# EAGLE design pokeymax4 (EAGLE 6.6.0)

## Sheet 1 of 7: IO
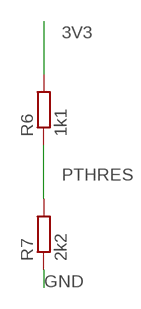
[diagram p0: schematic, sheet 1]

### Parts
R6  1k1  R-EU_R0402  [R0402]
R7  2k2  R-EU_R0402  [R0402]

### Nets
3V3: R6.2 ; also sheet 2,3,4,6
GND: R7.1 ; also sheet 2,3,4,5,6,7
PTHRES: R6.1 R7.2 ; also sheet 2

## Sheet 2 of 7: FPGA
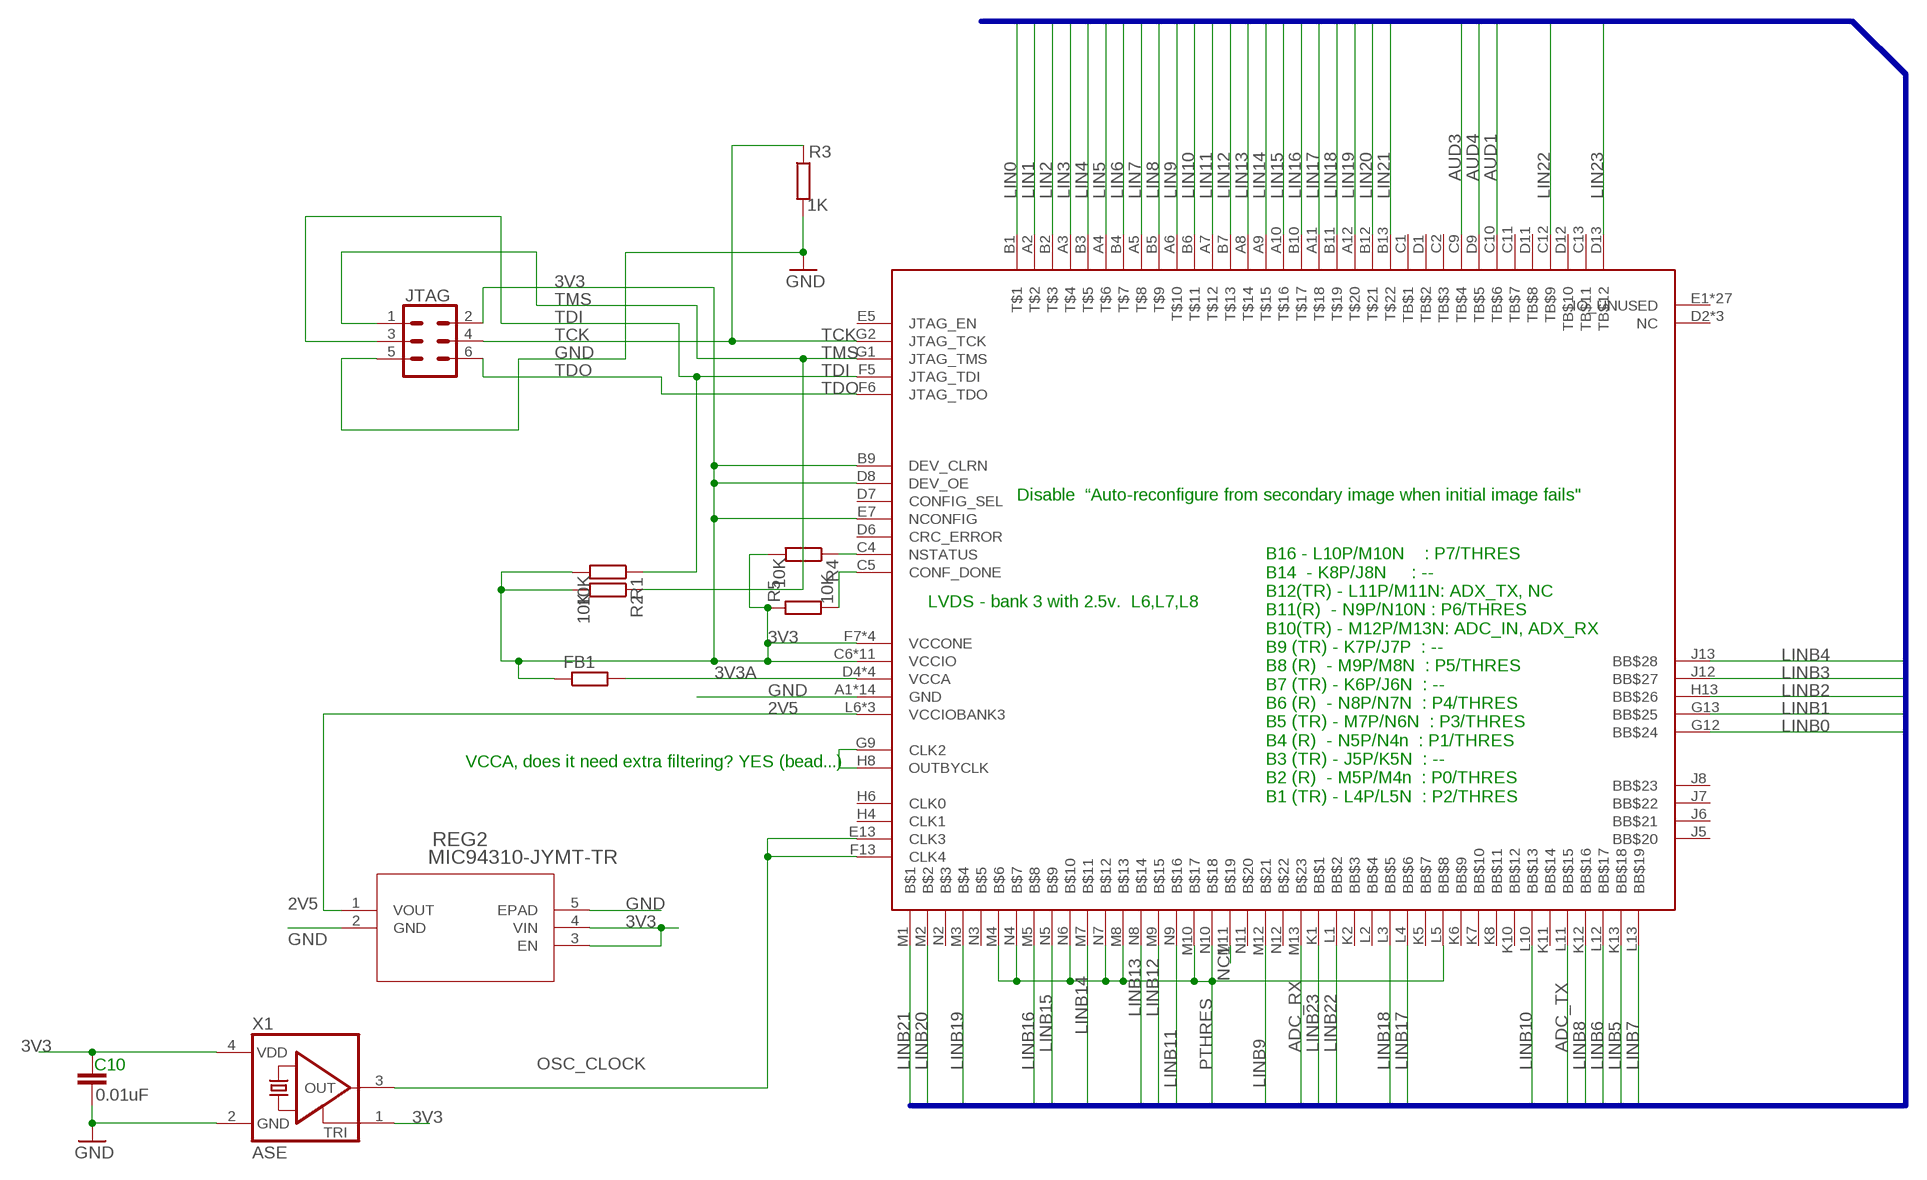
[diagram p1: schematic, sheet 2]

### Parts
C10  0.01uF  C-EUC0402  [C0402]
FB1  R-EU_R0402  [R0402]
JTAG  CONN_03X2LOCK  [2X3_LOCK]
R1  10K  R-EU_R0402  [R0402]
R2  10K  R-EU_R0402  [R0402]
R3  1K  R-EU_R0402  [R0402]
R4  10K  R-EU_R0402  [R0402]
R5  10K  R-EU_R0402  [R0402]
REG2  MIC94310-JYMT-TR  [TDFN4_1P2X1P6_MCH]
U3  MAX10  [U169SMALL]
X1  ASE  [ASE]

### Nets
2V5: REG2.1(VOUT) U3.L6(VCCIOBANK3) U3.L7(VCCIOBANK3) U3.L8(VCCIOBANK3) ; also sheet 6,7
3V3: C10.1 FB1.1 JTAG.2 R1.2 R2.2 R4.2 R5.1 REG2.3(EN) REG2.4(VIN) U3.B9(DEV_CLRN) U3.C6(VCCIO) U3.C7(VCCIO) U3.C8(VCCIO) U3.D8(DEV_OE) U3.E7(NCONFIG) U3.F2(VCCIO) U3.F7(VCCONE) U3.F11(VCCIO) U3.G3(VCCIO) U3.G6(VCCONE) U3.G8(VCCONE) U3.G11(VCCIO) U3.H7(VCCONE) U3.H11(VCCIO) U3.J3(VCCIO) U3.J11(VCCIO) U3.K3(VCCIO) X1.1(TRI) X1.4(VDD) ; also sheet 1,3,4,6
3V3A: FB1.2 U3.D4(VCCA) U3.D10(VCCA) U3.K4(VCCA) U3.K9(VCCA) ; also sheet 6
ADC_RX: U3.M13(B$23) ; also sheet 7
ADC_TX: U3.L11(BB$15) ; also sheet 7
AUD1: U3.C10(TB$6) ; also sheet 5
AUD3: U3.C9(TB$4) ; also sheet 5
AUD4: U3.D9(TB$5) ; also sheet 5
CONF_DONE: R5.2 U3.C5(CONF_DONE)
FAKE_CLK: U3.G9(CLK2) U3.H8(OUTBYCLK)
GND: C10.2 JTAG.5 R3.2 REG2.2(GND) REG2.5(EPAD) U3.A1(GND) U3.A13(GND) U3.B8(GND) U3.C3(GND) U3.D5(GND) U3.E11(GND) U3.F3(GND) U3.G7(GND) U3.H12(GND) U3.J4(GND) U3.L9(GND) U3.M6(GND) U3.N1(GND) U3.N13(GND) X1.2(GND) ; also sheet 1,3,4,5,6,7
LIN0: U3.B1(T$1) ; also sheet 3
LIN1: U3.A2(T$2) ; also sheet 3
LIN2: U3.B2(T$3) ; also sheet 3
LIN3: U3.A3(T$4) ; also sheet 3
LIN4: U3.B3(T$5) ; also sheet 3
LIN5: U3.A4(T$6) ; also sheet 3
LIN6: U3.B4(T$7) ; also sheet 3
LIN7: U3.A5(T$8) ; also sheet 3
LIN8: U3.B5(T$9) ; also sheet 3
LIN9: U3.A6(T$10) ; also sheet 3
LIN10: U3.B6(T$11) ; also sheet 3
LIN11: U3.A7(T$12) ; also sheet 3
LIN12: U3.B7(T$13) ; also sheet 3
LIN13: U3.A8(T$14) ; also sheet 3
LIN14: U3.A9(T$15) ; also sheet 3
LIN15: U3.A10(T$16) ; also sheet 3
LIN16: U3.B10(T$17) ; also sheet 3
LIN17: U3.A11(T$18) ; also sheet 3
LIN18: U3.B11(T$19) ; also sheet 3
LIN19: U3.A12(T$20) ; also sheet 3
LIN20: U3.B12(T$21) ; also sheet 3
LIN21: U3.B13(T$22) ; also sheet 3
LIN22: U3.C12(TB$9) ; also sheet 3
LIN23: U3.D13(TB$12) ; also sheet 3
LINB0: U3.G12(BB$24) ; also sheet 3
LINB1: U3.G13(BB$25) ; also sheet 3
LINB2: U3.H13(BB$26) ; also sheet 3
LINB3: U3.J12(BB$27) ; also sheet 3
LINB4: U3.J13(BB$28) ; also sheet 3
LINB5: U3.K13(BB$18) ; also sheet 3
LINB6: U3.L12(BB$17) ; also sheet 3
LINB7: U3.L13(BB$19) ; also sheet 3
LINB8: U3.K12(BB$16) ; also sheet 3
LINB9: U3.M12(B$21) ; also sheet 3,7
LINB10: U3.L10(BB$13) ; also sheet 3
LINB11: U3.N9(B$16) ; also sheet 3
LINB12: U3.M9(B$15) ; also sheet 3
LINB13: U3.N8(B$14) ; also sheet 3
LINB14: U3.M7(B$11) ; also sheet 3
LINB15: U3.N5(B$9) ; also sheet 3
LINB16: U3.M5(B$8) ; also sheet 3
LINB17: U3.L4(BB$6) ; also sheet 3
LINB18: U3.L3(BB$5) ; also sheet 3
LINB19: U3.M3(B$4) ; also sheet 3
LINB20: U3.M2(B$2) ; also sheet 3
LINB21: U3.M1(B$1) ; also sheet 3
LINB22: U3.L1(BB$2) ; also sheet 3
LINB23: U3.K1(BB$1) ; also sheet 3
NC1: U3.M11(B$19)
NSTATUS: R4.1 U3.C4(NSTATUS)
OSC_CLOCK: U3.E13(CLK3) U3.F13(CLK4) X1.3(OUT)
PTHRES: U3.L5(BB$8) U3.M4(B$6) U3.M8(B$13) U3.M10(B$17) U3.N4(B$7) U3.N6(B$10) U3.N7(B$12) U3.N10(B$18) ; also sheet 1
TCK: JTAG.4 R3.1 U3.G2(JTAG_TCK)
TDI: JTAG.3 R1.1 U3.F5(JTAG_TDI)
TDO: JTAG.6 U3.F6(JTAG_TDO)
TMS: JTAG.1 R2.1 U3.G1(JTAG_TMS)
Unconnected: U3.C1(TB$1) U3.C2(TB$3) U3.C11(TB$7) U3.C13(TB$11) U3.D1(TB$2) U3.D2(NC) U3.D3(NC) U3.D6(CRC_ERROR) U3.D7(CONFIG_SEL) U3.D11(TB$8) U3.D12(TB$10) U3.E1(IO_UNUSED) U3.E2(NC) U3.E3(IO_UNUSED) U3.E4(IO_UNUSED) U3.E5(JTAG_EN) U3.E6(IO_UNUSED) U3.E8(IO_UNUSED) U3.E9(IO_UNUSED) U3.E10(IO_UNUSED) U3.E12(IO_UNUSED) U3.F1(IO_UNUSED) U3.F4(IO_UNUSED) U3.F8(IO_UNUSED) U3.F9(IO_UNUSED) U3.F10(IO_UNUSED) U3.F12(IO_UNUSED) U3.G4(IO_UNUSED) U3.G5(IO_UNUSED) U3.G10(IO_UNUSED) U3.H1(IO_UNUSED) U3.H2(IO_UNUSED) U3.H3(IO_UNUSED) U3.H4(CLK1) U3.H5(IO_UNUSED) U3.H6(CLK0) U3.H9(IO_UNUSED) U3.H10(IO_UNUSED) U3.J1(IO_UNUSED) U3.J2(IO_UNUSED) U3.J5(BB$20) U3.J6(BB$21) U3.J7(BB$22) U3.J8(BB$23) U3.J9(IO_UNUSED) U3.J10(IO_UNUSED) U3.K2(BB$3) U3.K5(BB$7) U3.K6(BB$9) U3.K7(BB$10) U3.K8(BB$11) U3.K10(BB$12) U3.K11(BB$14) U3.L2(BB$4) U3.N2(B$3) U3.N3(B$5) U3.N11(B$20) U3.N12(B$22)

### Buses
LINB[0..23],LIN[0..23],AUD[1..4],POTM[0..7],PTHRES,ADC_RX,ADC_TX

### Notes on the sheet
- Disable  “Auto-reconfigure from secondary image when initial image fails"
- LVDS - bank 3 with 2.5v.  L6,L7,L8
- VCCA, does it need extra filtering? YES (bead...)
- B16 - L10P/M10N    : P7/THRES
  B14  - K8P/J8N     : --
  B12(TR) - L11P/M11N: ADX_TX, NC
  B11(R)  - N9P/N10N : P6/THRES
  B10(TR) - M12P/M13N: ADC_IN, ADX_RX
  B9 (TR) - K7P/J7P  : --
  B8 (R)  - M9P/M8N  : P5/THRES
  B7 (TR) - K6P/J6N  : --
  B6 (R)  - N8P/N7N  : P4/THRES
  B5 (TR) - M7P/N6N  : P3/THRES
  B4 (R)  - N5P/N4n  : P1/THRES
  B3 (TR) - J5P/K5N  : --
  B2 (R)  - M5P/M4n  : P0/THRES
  B1 (TR) - L4P/L5N  : P2/THRES

## Sheet 3 of 7: Level conv
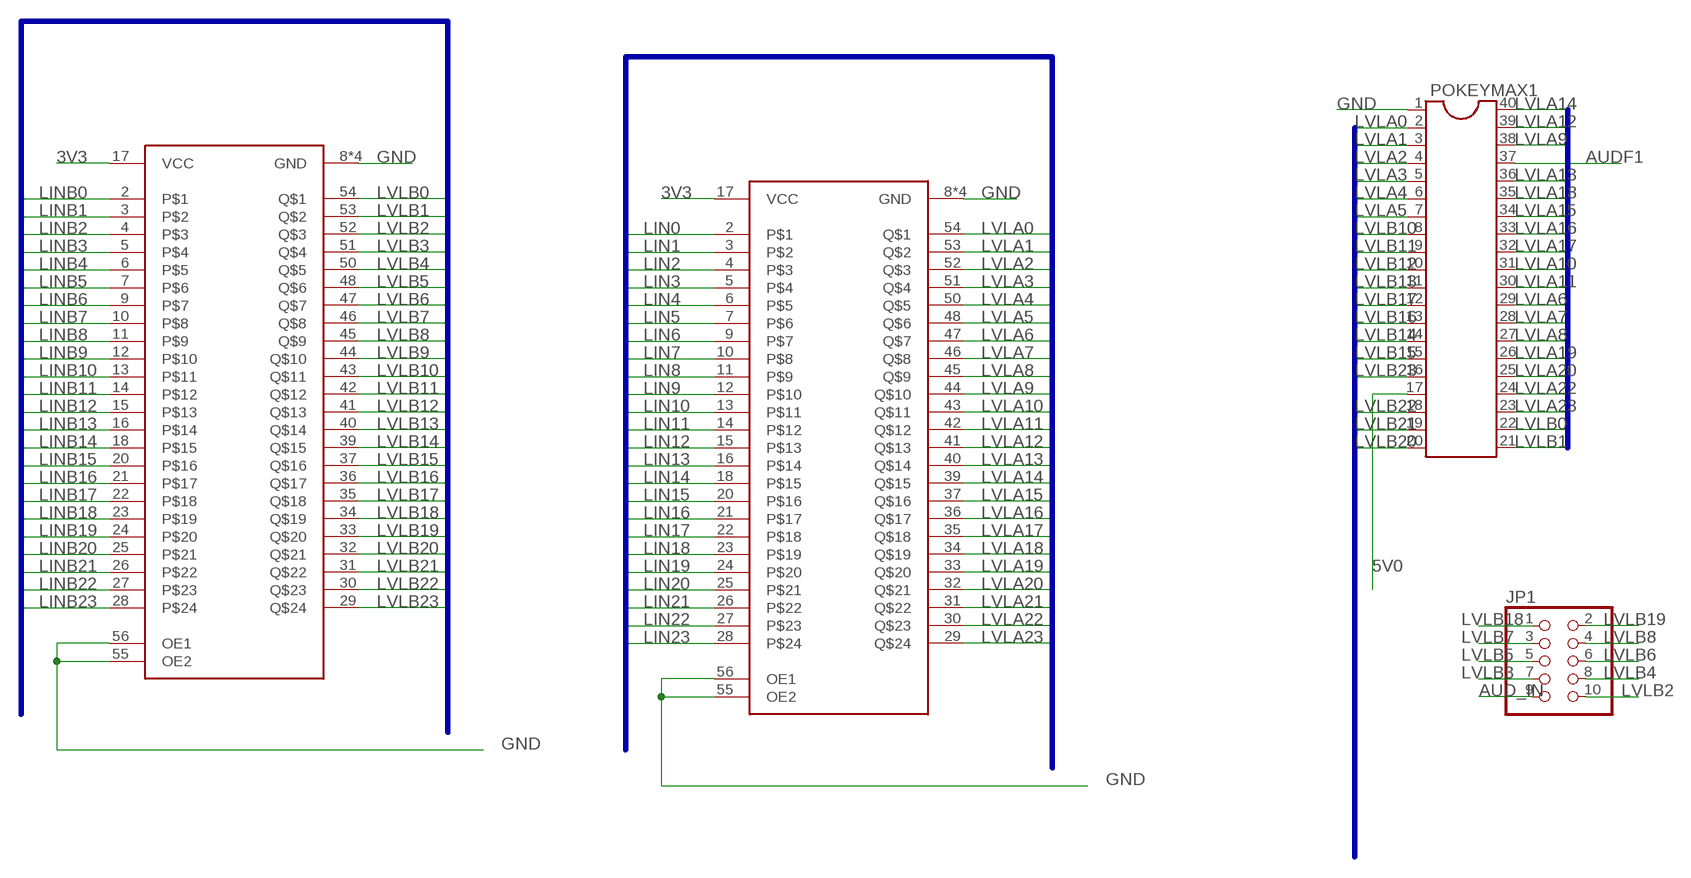
[diagram p2: schematic, sheet 3]

### Parts
JP1  PINHD-2X5  [2X05]
POKEYMAX1  DIL40  [DIL40]
U2  SN74CB3T16211SM  [56TVSOP_SMALL]
U4  SN74CB3T16211SM  [56TVSOP_SMALL]

### Nets
3V3: U2.17(VCC) U4.17(VCC) ; also sheet 1,2,4,6
5V0: POKEYMAX1.17 ; also sheet 4,5,6
AUD_IN: JP1.9 ; also sheet 7
AUDF1: POKEYMAX1.37 ; also sheet 5
GND: POKEYMAX1.1 U2.8(GND) U2.19(GND) U2.38(GND) U2.49(GND) U2.55(OE2) U2.56(OE1) U4.8(GND) U4.19(GND) U4.38(GND) U4.49(GND) U4.55(OE2) U4.56(OE1) ; also sheet 1,2,4,5,6,7
LIN0: U2.2 ; also sheet 2
LIN1: U2.3 ; also sheet 2
LIN2: U2.4 ; also sheet 2
LIN3: U2.5 ; also sheet 2
LIN4: U2.6 ; also sheet 2
LIN5: U2.7 ; also sheet 2
LIN6: U2.9 ; also sheet 2
LIN7: U2.10 ; also sheet 2
LIN8: U2.11 ; also sheet 2
LIN9: U2.12 ; also sheet 2
LIN10: U2.13 ; also sheet 2
LIN11: U2.14 ; also sheet 2
LIN12: U2.15 ; also sheet 2
LIN13: U2.16 ; also sheet 2
LIN14: U2.18 ; also sheet 2
LIN15: U2.20 ; also sheet 2
LIN16: U2.21 ; also sheet 2
LIN17: U2.22 ; also sheet 2
LIN18: U2.23 ; also sheet 2
LIN19: U2.24 ; also sheet 2
LIN20: U2.25 ; also sheet 2
LIN21: U2.26 ; also sheet 2
LIN22: U2.27 ; also sheet 2
LIN23: U2.28 ; also sheet 2
LINB0: U4.2 ; also sheet 2
LINB1: U4.3 ; also sheet 2
LINB2: U4.4 ; also sheet 2
LINB3: U4.5 ; also sheet 2
LINB4: U4.6 ; also sheet 2
LINB5: U4.7 ; also sheet 2
LINB6: U4.9 ; also sheet 2
LINB7: U4.10 ; also sheet 2
LINB8: U4.11 ; also sheet 2
LINB9: U4.12 ; also sheet 2,7
LINB10: U4.13 ; also sheet 2
LINB11: U4.14 ; also sheet 2
LINB12: U4.15 ; also sheet 2
LINB13: U4.16 ; also sheet 2
LINB14: U4.18 ; also sheet 2
LINB15: U4.20 ; also sheet 2
LINB16: U4.21 ; also sheet 2
LINB17: U4.22 ; also sheet 2
LINB18: U4.23 ; also sheet 2
LINB19: U4.24 ; also sheet 2
LINB20: U4.25 ; also sheet 2
LINB21: U4.26 ; also sheet 2
LINB22: U4.27 ; also sheet 2
LINB23: U4.28 ; also sheet 2
LVLA0: POKEYMAX1.2 U2.54(Q$1)
LVLA1: POKEYMAX1.3 U2.53(Q$2)
LVLA2: POKEYMAX1.4 U2.52(Q$3)
LVLA3: POKEYMAX1.5 U2.51(Q$4)
LVLA4: POKEYMAX1.6 U2.50(Q$5)
LVLA5: POKEYMAX1.7 U2.48(Q$6)
LVLA6: POKEYMAX1.29 U2.47(Q$7)
LVLA7: POKEYMAX1.28 U2.46(Q$8)
LVLA8: POKEYMAX1.27 U2.45(Q$9)
LVLA9: POKEYMAX1.38 U2.44(Q$10)
LVLA10: POKEYMAX1.31 U2.43(Q$11)
LVLA11: POKEYMAX1.30 U2.42(Q$12)
LVLA12: POKEYMAX1.39 U2.41(Q$13)
LVLA13: POKEYMAX1.36 U2.40(Q$14)
LVLA14: POKEYMAX1.40 U2.39(Q$15)
LVLA15: POKEYMAX1.34 U2.37(Q$16)
LVLA16: POKEYMAX1.33 U2.36(Q$17)
LVLA17: POKEYMAX1.32 U2.35(Q$18)
LVLA18: POKEYMAX1.35 U2.34(Q$19)
LVLA19: POKEYMAX1.26 U2.33(Q$20)
LVLA20: POKEYMAX1.25 U2.32(Q$21)
LVLA21: U2.31(Q$22) ; also sheet 5
LVLA22: POKEYMAX1.24 U2.30(Q$23)
LVLA23: POKEYMAX1.23 U2.29(Q$24)
LVLB0: POKEYMAX1.22 U4.54(Q$1)
LVLB1: POKEYMAX1.21 U4.53(Q$2)
LVLB2: JP1.10 U4.52(Q$3)
LVLB3: JP1.7 U4.51(Q$4)
LVLB4: JP1.8 U4.50(Q$5)
LVLB5: JP1.5 U4.48(Q$6)
LVLB6: JP1.6 U4.47(Q$7)
LVLB7: JP1.3 U4.46(Q$8)
LVLB8: JP1.4 U4.45(Q$9)
LVLB9: U4.44(Q$10) ; also sheet 7
LVLB10: POKEYMAX1.8 U4.43(Q$11)
LVLB11: POKEYMAX1.9 U4.42(Q$12)
LVLB12: POKEYMAX1.10 U4.41(Q$13)
LVLB13: POKEYMAX1.11 U4.40(Q$14)
LVLB14: POKEYMAX1.14 U4.39(Q$15)
LVLB15: POKEYMAX1.15 U4.37(Q$16)
LVLB16: POKEYMAX1.13 U4.36(Q$17)
LVLB17: POKEYMAX1.12 U4.35(Q$18)
LVLB18: JP1.1 U4.34(Q$19)
LVLB19: JP1.2 U4.33(Q$20)
LVLB20: POKEYMAX1.20 U4.32(Q$21)
LVLB21: POKEYMAX1.19 U4.31(Q$22)
LVLB22: POKEYMAX1.18 U4.30(Q$23)
LVLB23: POKEYMAX1.16 U4.29(Q$24)

### Buses
LINB[0..23],LVLB[0..23]
LVLA[0..23],LVLB[0..7],KR[1..2],K[0..5]
LVLA[0..23],LVLB[0..23],POT[0..7],POTCH[0..7],KR[1..2],K[0..5]
LIN[0..23],LVLA[0..23]

## Sheet 4 of 7: Power regs
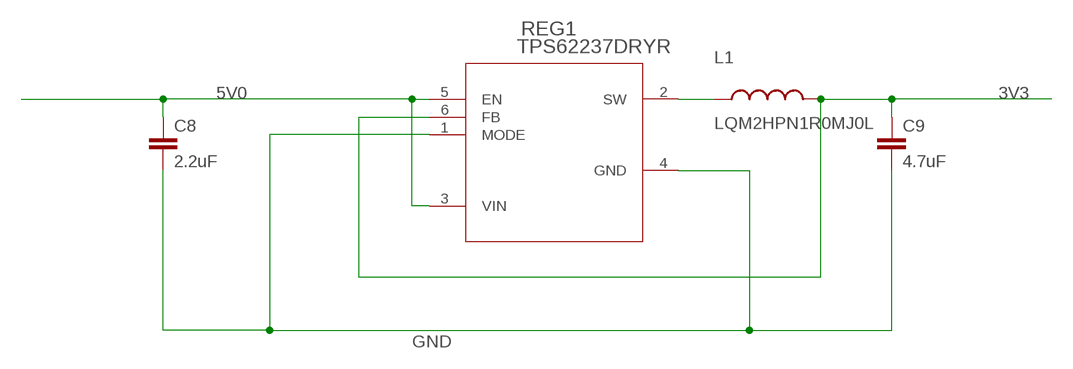
[diagram p3: schematic, sheet 4]

### Parts
C8  2.2uF  C-EUC0402  [C0402]
C9  4.7uF  C-EUC0402  [C0402]
L1  LQM2HPN1R0MJ0L  [INDC1008X04]
REG1  TPS62237DRYR  [DRY6]

### Nets
3V3: C9.1 L1.2 REG1.6(FB) ; also sheet 1,2,3,6
5V0: C8.1 REG1.3(VIN) REG1.5(EN) ; also sheet 3,5,6
GND: C8.2 C9.2 REG1.1(MODE) REG1.4(GND) ; also sheet 1,2,3,5,6,7
N$137: L1.1 REG1.2(SW)

## Sheet 5 of 7: Audio filter
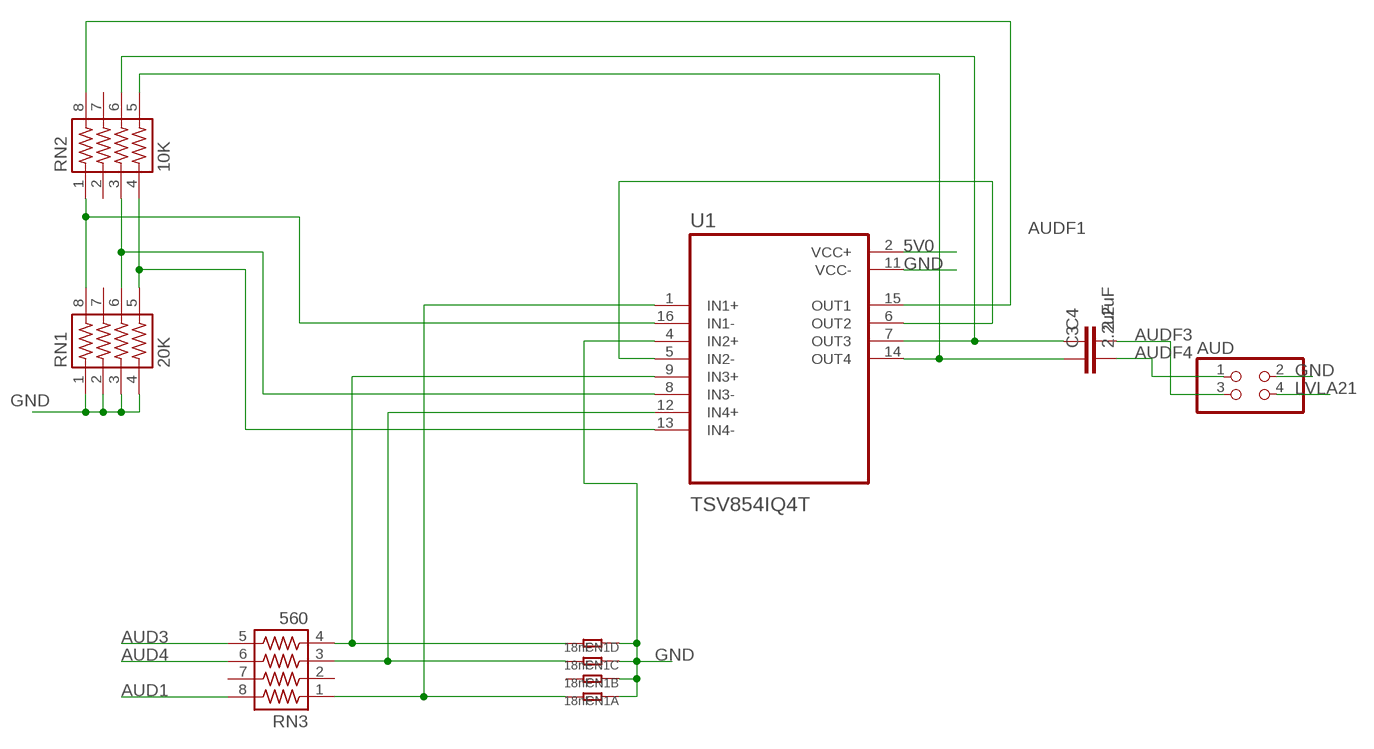
[diagram p4: schematic, sheet 5]

### Parts
AUD  PINHD-2X2  [2X02]
C3  2.2uF  C-EUC0402  [C0402]
C4  2.2uF  C-EUC0402  [C0402]
CN1  18nF  R-4R  [R1206-8]
RN1  20K  741-8  [741-8]
RN2  10K  741-8  [741-8]
RN3  560  741-8  [741-8]
U1  TSV854IQ4T  [QFN50P300X300X100-16N]

### Nets
5V0: U1.2(VCC+) ; also sheet 3,4,6
AMPIN1M: RN1.8 RN2.1 U1.16(IN1-)
AMPIN1P: CN1.8 RN3.1 U1.1(IN1+)
AMPIN3M: RN1.6 RN2.3 U1.8(IN3-)
AMPIN3P: CN1.5 RN3.4 U1.9(IN3+)
AMPIN4P: CN1.6 RN3.3 U1.12(IN4+)
AUD1: RN3.8 ; also sheet 2
AUD3: RN3.5 ; also sheet 2
AUD4: RN3.6 ; also sheet 2
AUDF1: RN2.8 U1.15(OUT1) ; also sheet 3
AUDF2: U1.5(IN2-) U1.6(OUT2)
AUDF3: AUD.3 C4.2
AUDF4: AUD.1 C3.2
GND: AUD.2 CN1.1 CN1.2 CN1.3 CN1.4 RN1.1 RN1.2 RN1.3 RN1.4 U1.4(IN2+) U1.11(VCC-) ; also sheet 1,2,3,4,6,7
LVLA21: AUD.4 ; also sheet 3
N$5: C3.1 RN2.5 U1.14(OUT4)
N$7: C4.1 RN2.6 U1.7(OUT3)
N$22: RN1.5 RN2.4 U1.13(IN4-)
Unconnected: CN1.7 RN1.7 RN2.2 RN2.7 RN3.2 RN3.7

## Sheet 6 of 7: Decoupling
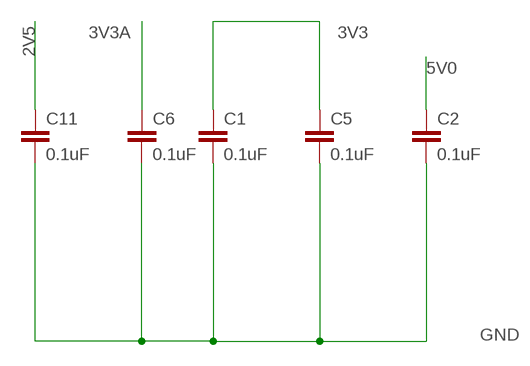
[diagram p5: schematic, sheet 6]

### Parts
C1  0.1uF  C-EUC0402  [C0402]
C2  0.1uF  C-EUC0402  [C0402]
C5  0.1uF  C-EUC0402  [C0402]
C6  0.1uF  C-EUC0402  [C0402]
C11  0.1uF  C-EUC0402  [C0402]

### Nets
2V5: C11.1 ; also sheet 2,7
3V3: C1.1 C5.1 ; also sheet 1,2,3,4
3V3A: C6.1 ; also sheet 2
5V0: C2.1 ; also sheet 3,4,5
GND: C1.2 C2.2 C5.2 C6.2 C11.2 ; also sheet 1,2,3,4,5,7

## Sheet 7 of 7: ADC
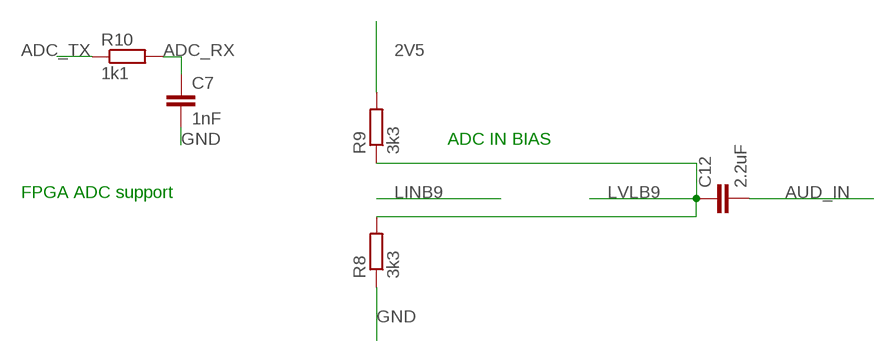
[diagram p6: schematic, sheet 7]

### Parts
C7  1nF  C-EUC0402  [C0402]
C12  2.2uF  C-EUC0402  [C0402]
R8  3k3  R-EU_R0402  [R0402]
R9  3k3  R-EU_R0402  [R0402]
R10  1k1  R-EU_R0402  [R0402]

### Nets
2V5: R9.2 ; also sheet 2,6
ADC_RX: C7.1 R10.2 ; also sheet 2
ADC_TX: R10.1 ; also sheet 2
AUD_IN: C12.2 ; also sheet 3
GND: C7.2 R8.1 ; also sheet 1,2,3,4,5,6
LVLB9: C12.1 R8.2 R9.1 ; also sheet 3

### Notes on the sheet
- ADC IN BIAS
- FPGA ADC support

## Library data of the parts
AUD = pinhead:PINHD-2X2: PIN HEADER
C1-C12 = rcl:C-EU: CAPACITOR, European symbol
CN1 = Discrete:R-4R*: Resistor Array
FB1 R1-R10 = rcl:R-EU_: RESISTOR, European symbol
JP1 = pinhead:PINHD-2X5: PIN HEADER
JTAG = SparkFun-Connectors:CONN_03X2: Multi connection point. Often used as Generic Header-pin footprint for 0.1 inch spaced/style header connections You can populate with any combo of single row headers, but if you'd like an exact match, check these: Header - 2x3 (Male, 0.1") <https://www.sparkfun.com/products/12807> (PRT-12807) Header - 2x3 (Female, 0.1") <https://www.sparkfun.com/products/13010> (PRT-13010) 2x3 Pin Shrouded Header <https://www.sparkfun.com/products/10877> (PRT-10877) On any of the 0.1 inch spaced packages, you can populate with these: Break Away Headers - Straight <https://www.sparkfun.com/products/116> (PRT-00116) Break Away Male Headers - Right Angle <https://www.sparkfun.com/products/553> (PRT-00553) Female Headers <https://www.sparkfun.com/products/115> (PRT-00115) Break Away Headers - Machine Pin <https://www.sparkfun.com/products/117> (PRT-00117) Break Away Female Headers - Swiss Machine Pin <https://www.sparkfun.com/products/743> (PRT-00743) Special note: the shrouded connector mates well with our 3x2 ribbon cables: Ribbon Crimp Connector - 6-pin (2x3, Female) <https://www.sparkfun.com/products/10651> (PRT-10651) Ribbon Cable - 6 wire (15ft) <https://www.sparkfun.com/products/10646> (PRT-10646)
L1 = LQM2HPN1R0MJ0L:LQM2HPN1R0MJ0L: Inductor Power Chip Shielded Multi-Layer 1uH 20% 1MHz Ferrite 1.5A 113mOhm DCR 1008 Embossed T/R; DESCRIPTION: Inductor Power Chip Shielded Multi-Layer 1uH 20% 1MHz Ferrite 1.5A 113mOhm DCR 1008 Embossed T/R; DIGI-KEY_PART_NUMBER: 490-6699-1-ND; DIGI-KEY_PURCHASE_URL: https://www.digikey.com/product-detail/en/murata-electronics-north-america/LQM2HPN1R0MJ0L/490-6699-1-ND/3845896?utm_source=snapeda&utm_medium=aggregator&utm_campaign=symbol; MF: Murata Electronics; MP: LQM2HPN1R0MJ0L; PACKAGE: 1008 Murata
POKEYMAX1 = ic-package:DIL40: Dual In Line
REG1 = max10:TPS62237DRYR; MANUFACTURER_PART_NUMBER: TPS62237DRYR; VENDOR: Texas Instruments
REG2 = max10:MIC94310-JYMT-TR; BUILT_BY: EMA_Jessica; COPYRIGHT: Copyright (C) 2018 Accelerated Designs. All rights reserved; MANUFACTURER_PART_NUMBER: MIC94310-JYMT-TR; SOURCELIBRARY: Microchip_2019-08-23_18; VENDOR: Microchip
RN1-RN3 = resistor-array:741-8: CTS 741 Series 8 Terminations, 4 Resistors
U1 = TSV854IQ4T:TSV854IQ4T: None; AVAILABILITY: Unavailable; DESCRIPTION: General Purpose Amplifier 4 Circuit Rail-to-Rail 16-QFN _3x3_; MF: STMicroelectronics; MP: TSV854IQ4T; PACKAGE: QFN-16 STMicroelectronics; PRICE: None
U2 U4 = max10:SN74CB3T16211
U3 = max10:MAX10
X1 = crystal:ASE: 3.3Vdc CMOS SMD CRYSTAL CLOCK OSCILLATOR SOurce: www.abracon.com; OC_FARNELL: unknown; OC_NEWARK: unknown

## Board
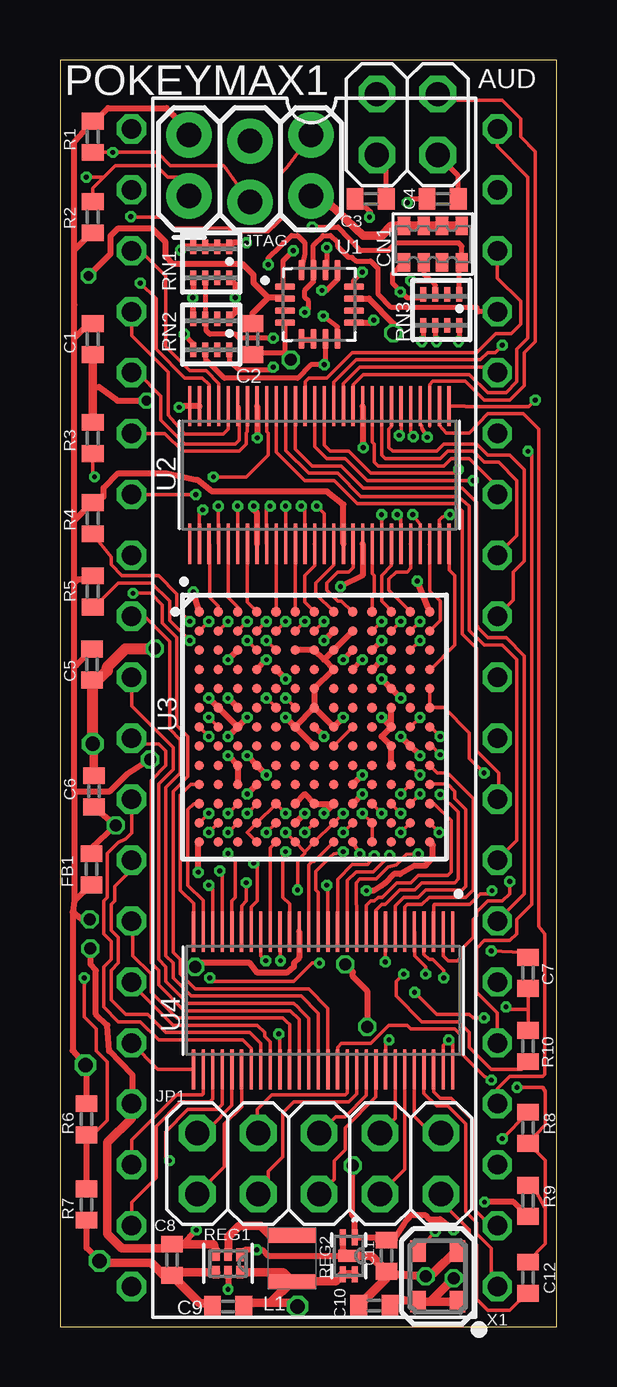
[diagram p7: board, top side]
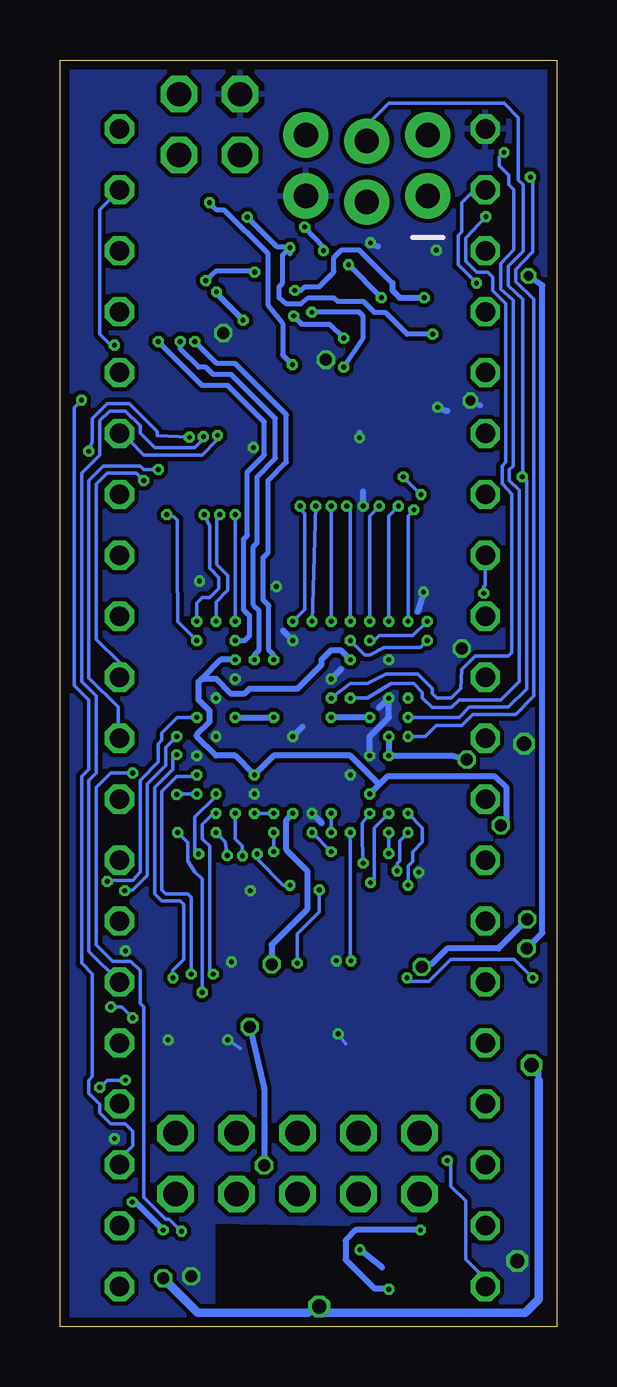
[diagram p8: board, bottom side, seen from below]

Size 20.7 x 52.8 mm. Coordinates in mm from the lower left corner, seen from the top.
Outline: 20.7,52.8 0,52.8 0,0 20.7,0 20.7,52.8
Copper layers (1*2*15*16): Top 0.035559375mm / dielectric 1.6mm / Route2 0.0356mm / dielectric 0.1499mm / Route15 0.0356mm / dielectric 0.2007mm / Bottom 0.035559375mm
Design rules "oshpark-2layer_5mil *": minimum track width 6mil, minimum drill 0.2mm, track to track 5mil, track to pad 5mil, pad to pad 5mil, via to via 5mil, smd to smd 5mil, copper to edge 15mil, drill to drill 6mil, minimum pad ring 5mil, minimum via ring 5mil, stop-mask expansion 2.5mil, vias tented up to drill 20mil, thermal gap 10mil

### Footprints (pad centres in the part's own frame; a part is rotated, then mirrored left to right if it is on the bottom)
2X02 = drill 1.016 octagon: 1 -1.27,-1.27; 2 -1.27,1.27; 3 1.27,-1.27; 4 1.27,1.27
C0402 = smd 0.7 x 0.9: 1 -0.65,0; 2 0.65,0
R1206-8 = smd 0.508 x 0.762: 1 -1.206,-0.762; 2 -0.381,-0.762; 3 0.381,-0.762; 4 1.206,-0.762; 5 1.206,0.762; 6 0.381,0.762; 7 -0.381,0.762; 8 -1.206,0.762
R0402 = smd 0.7 x 0.9: 1 -0.65,0; 2 0.65,0
2X05 = drill 1.016 octagon: 1 -5.08,-1.27; 2 -5.08,1.27; 3 -2.54,-1.27; 4 -2.54,1.27; 5 0,-1.27; 6 0,1.27; 7 2.54,-1.27; 8 2.54,1.27; 9 5.08,-1.27; 10 5.08,1.27
2X3_LOCK = drill 1.016 pad 1.88: 1 0,0.127; 2 0,2.667; 3 2.54,-0.127; 4 2.54,2.413; 5 5.08,0.127; 6 5.08,2.667
INDC1008X04 = smd 0.6 x 2: 1 -0.95,0; 2 0.95,0
DIL40 = drill 0.813 octagon: 1 -24.13,-7.62; 2 -21.59,-7.62; 3 -19.05,-7.62; 4 -16.51,-7.62; 5 -13.97,-7.62; 6 -11.43,-7.62; 7 -8.89,-7.62; 8 -6.35,-7.62; 9 -3.81,-7.62; 10 -1.27,-7.62; 11 1.27,-7.62; 12 3.81,-7.62; 13 6.35,-7.62; 14 8.89,-7.62; 15 11.43,-7.62; 16 13.97,-7.62; 17 16.51,-7.62; 18 19.05,-7.62; 19 21.59,-7.62; 20 24.13,-7.62; 21 24.13,7.62; 22 21.59,7.62; 23 19.05,7.62; 24 16.51,7.62; 25 13.97,7.62; 26 11.43,7.62; 27 8.89,7.62; 28 6.35,7.62; 29 3.81,7.62; 30 1.27,7.62; 31 -1.27,7.62; 32 -3.81,7.62; 33 -6.35,7.62; 34 -8.89,7.62; 35 -11.43,7.62; 36 -13.97,7.62; 37 -16.51,7.62; 38 -19.05,7.62; 39 -21.59,7.62; 40 -24.13,7.62
DRY6 = smd 0.55 x 0.3: 1 -0.355,0.5 | smd 0.52 x 0.3: 2 -0.37,0; 3 -0.37,-0.5; 4 0.37,-0.5; 5 0.37,0; 6 0.37,0.5
TDFN4_1P2X1P6_MCH = smd 0.66 x 0.254: 1 -0.775,0.254; 2 -0.775,-0.254; 3 0.775,-0.254; 4 0.775,0.254 | smd 0.508 x 0.864: 5 0,0
741-8 = smd 0.25 x 0.61: 1 -0.75,-0.65; 2 -0.25,-0.65; 3 0.25,-0.65; 4 0.75,-0.65; 5 0.75,0.65; 6 0.25,0.65; 7 -0.25,0.65; 8 -0.75,0.65
QFN50P300X300X100-16N = smd 0.84 x 0.26: 1 -1.435,0.75; 2 -1.435,0.25; 3 -1.435,-0.25; 4 -1.435,-0.75; 9 1.435,-0.75; 10 1.435,-0.25; 11 1.435,0.25; 12 1.435,0.75 | smd 0.26 x 0.84: 5 -0.75,-1.435; 6 -0.25,-1.435; 7 0.25,-1.435; 8 0.75,-1.435; 13 0.75,1.435; 14 0.25,1.435; 15 -0.25,1.435; 16 -0.75,1.435
56TVSOP_SMALL = smd 1.676 x 0.178: 1 -2.87,5.4; 2 -2.87,5; 3 -2.87,4.6; 4 -2.87,4.2; 5 -2.87,3.8; 6 -2.87,3.4; 7 -2.87,3; 8 -2.87,2.6; 9 -2.87,2.2; 10 -2.87,1.8; 11 -2.87,1.4; 12 -2.87,1; 13 -2.87,0.6; 14 -2.87,0.2; 15 -2.87,-0.2; 16 -2.87,-0.6; 17 -2.87,-1; 18 -2.87,-1.4; 19 -2.87,-1.8; 20 -2.87,-2.2; 21 -2.87,-2.6; 22 -2.87,-3; 23 -2.87,-3.4; 24 -2.87,-3.8; 25 -2.87,-4.2; 26 -2.87,-4.6; 27 -2.87,-5; 28 -2.87,-5.4; 29 2.87,-5.4; 30 2.87,-5; 31 2.87,-4.6; 32 2.87,-4.2; 33 2.87,-3.8; 34 2.87,-3.4; 35 2.87,-3; 36 2.87,-2.6; 37 2.87,-2.2; 38 2.87,-1.8; 39 2.87,-1.4; 40 2.87,-1; 41 2.87,-0.6; 42 2.87,-0.2; 43 2.87,0.2; 44 2.87,0.6; 45 2.87,1; 46 2.87,1.4; 47 2.87,1.8; 48 2.87,2.2; 49 2.87,2.6; 50 2.87,3; 51 2.87,3.4; 52 2.87,3.8; 53 2.87,4.2; 54 2.87,4.6; 55 2.87,5; 56 2.87,5.4
U169SMALL = smd 0.4 x 0.4: A1 -4.8,4.8; A2 -4,4.8; A3 -3.2,4.8; A4 -2.4,4.8; A5 -1.6,4.8; A6 -0.8,4.8; A7 0,4.8; A8 0.8,4.8; A9 1.6,4.8; A10 2.4,4.8; A11 3.2,4.8; A12 4,4.8; A13 4.8,4.8; B1 -4.8,4; B2 -4,4; B3 -3.2,4; B4 -2.4,4; B5 -1.6,4; B6 -0.8,4; B7 0,4; B8 0.8,4; B9 1.6,4; B10 2.4,4; B11 3.2,4; B12 4,4; B13 4.8,4; C1 -4.8,3.2; C2 -4,3.2; C3 -3.2,3.2; C4 -2.4,3.2; C5 -1.6,3.2; C6 -0.8,3.2; C7 0,3.2; C8 0.8,3.2; C9 1.6,3.2; C10 2.4,3.2; C11 3.2,3.2; C12 4,3.2; C13 4.8,3.2; D1 -4.8,2.4; D2 -4,2.4; D3 -3.2,2.4; D4 -2.4,2.4; D5 -1.6,2.4; D6 -0.8,2.4; D7 0,2.4; D8 0.8,2.4; D9 1.6,2.4; D10 2.4,2.4; D11 3.2,2.4; D12 4,2.4; D13 4.8,2.4; E1 -4.8,1.6; E2 -4,1.6; E3 -3.2,1.6; E4 -2.4,1.6; E5 -1.6,1.6; E6 -0.8,1.6; E7 0,1.6; E8 0.8,1.6; E9 1.6,1.6; E10 2.4,1.6; E11 3.2,1.6; E12 4,1.6; E13 4.8,1.6; F1 -4.8,0.8; F2 -4,0.8; F3 -3.2,0.8; F4 -2.4,0.8; F5 -1.6,0.8; F6 -0.8,0.8; F7 0,0.8; F8 0.8,0.8; F9 1.6,0.8; F10 2.4,0.8; F11 3.2,0.8; F12 4,0.8; F13 4.8,0.8; G1 -4.8,0; G2 -4,0; G3 -3.2,0; G4 -2.4,0; G5 -1.6,0; G6 -0.8,0; G7 0,0; G8 0.8,0; G9 1.6,0; G10 2.4,0; G11 3.2,0; G12 4,0; G13 4.8,0; H1 -4.8,-0.8; H2 -4,-0.8; H3 -3.2,-0.8; H4 -2.4,-0.8; H5 -1.6,-0.8; H6 -0.8,-0.8; H7 0,-0.8; H8 0.8,-0.8; H9 1.6,-0.8; H10 2.4,-0.8; H11 3.2,-0.8; H12 4,-0.8; H13 4.8,-0.8; J1 -4.8,-1.6; J2 -4,-1.6; J3 -3.2,-1.6; J4 -2.4,-1.6; J5 -1.6,-1.6; J6 -0.8,-1.6; J7 0,-1.6; J8 0.8,-1.6; J9 1.6,-1.6; J10 2.4,-1.6; J11 3.2,-1.6; J12 4,-1.6; J13 4.8,-1.6; K1 -4.8,-2.4; K2 -4,-2.4; K3 -3.2,-2.4; K4 -2.4,-2.4; K5 -1.6,-2.4; K6 -0.8,-2.4; K7 0,-2.4; K8 0.8,-2.4; K9 1.6,-2.4; K10 2.4,-2.4; K11 3.2,-2.4; K12 4,-2.4; K13 4.8,-2.4; L1 -4.8,-3.2; L2 -4,-3.2; L3 -3.2,-3.2; L4 -2.4,-3.2; L5 -1.6,-3.2; L6 -0.8,-3.2; L7 0,-3.2; L8 0.8,-3.2; L9 1.6,-3.2; L10 2.4,-3.2; L11 3.2,-3.2; L12 4,-3.2; L13 4.8,-3.2; M1 -4.8,-4; M2 -4,-4; M3 -3.2,-4; M4 -2.4,-4; M5 -1.6,-4; M6 -0.8,-4; M7 0,-4; M8 0.8,-4; M9 1.6,-4; M10 2.4,-4; M11 3.2,-4; M12 4,-4; M13 4.8,-4; N1 -4.8,-4.8; N2 -4,-4.8; N3 -3.2,-4.8; N4 -2.4,-4.8; N5 -1.6,-4.8; N6 -0.8,-4.8; N7 0,-4.8; N8 0.8,-4.8; N9 1.6,-4.8; N10 2.4,-4.8; N11 3.2,-4.8; N12 4,-4.8; N13 4.8,-4.8
ASE = smd 0.9 x 0.65: 1 -1.05,-0.825; 2 1.05,-0.825; 3 1.05,0.825; 4 -1.05,0.825

### Placement (x,y rotation side)
AUD  14.47,50.1 0 top
C1  1.36,41.16 270 top
C2  8.02,41.16 270 top
C3  12.95,47.01 0 top
C4  15.94,47.01 0 top
C5  1.34,27.6 270 top
C6  1.41,22.32 90 top
C7  19.5,14.75 90 top
C8  4.67,2.79 270 top
C9  7,0.84 180 top
C10  13.1,0.88 180 top
C11  13.61,2.96 270 top
C12  19.5,2.05 270 top
CN1  15.54,45.13 180 top
FB1  1.31,19.07 90 top
JP1  10.8,6.8 0 top
JTAG  5.38,47.01 0 top
L1  9.67,2.84 270 top
POKEYMAX1  10.6,25.8 270 top
R1  1.36,49.6 90 top
R2  1.36,46.24 270 top
R3  1.36,37.04 90 top
R4  1.36,33.7 90 top
R5  1.36,30.65 270 top
R6  1.11,8.65 90 top
R7  1.11,5.1 90 top
R8  19.5,8.3 270 top
R9  19.5,5.25 270 top
R10  19.5,11.7 90 top
REG1  7,2.64 270 top
REG2  12.03,2.96 270 top
RN1  6.3,44.36 180 top
RN2  6.3,41.36 180 top
RN3  15.89,42.38 180 top
U1  10.81,42.61 0 top
U2  10.81,35.5 90 top
U3  10.6,25 0 top
U4  10.96,13.6 270 top
X1  15.74,2.1 90 top

### Tracks (layer width: path | path; a pad name or v marks a point on that pad's centre or on a via)
2V5  (via drill 0.2, 0.5)
  Top 0.254: 13.48,3.43 C11.1 | U3.L6 10.2,22.2 U3.L7 U3.L8 v11,21.4 | v12.8,12.51 12.8,14 12.2,14.6 12.2,14.78 v11.88,15.1 | 13.24,3.56 C11.1 | v12.2,6.72 12.18,6.71 12.18,4.64 12.29,4.54 REG2.1 13.49,3.73 C11.1 | C11.1 13.97,3.61 | R9.2 18.9,5.2 v17.69,5.2 | C11.1 13.9,3.61 14.47,4.49 14.62,4.64 15.23,4.64 15.38,4.49 15.84,4.49 v16.4,4.03
  Bottom 0.254: v12.8,12.51 12.2,9.92 v12.2,6.72 | v17.69,5.2 17.57,5.2 v16.4,4.03 | v11.88,15.1 11.88,15.92 10.4,17.39 10.4,19 11,19.6 11,19.61 11.27,19.88 11.27,21.13 v11,21.4
3V3  (via drill 0.2, 0.5, 0.6)
  Top 0.203: 0.6,42.81 0.6,42.59
  Top 0.254: U3.J11 U3.H11 13.4,24.6 U3.G11 | U3.G11 U3.F11 | U3.C6 U3.C7 11,27.8 | U3.B9 U3.C8 11,27.8 | U3.F7 U3.G8 v11.8,25.4 | U3.F7 U3.E7 U3.D8 11,27.8 | U3.F7 U3.G6 | U3.H7 U3.G6 | U3.K3 U3.J3 v7,23.8 | 7.5,0.99 C9.1 | 0.6,22.32 0.6,27.5 | 0.6,27.5 0.6,31 | 0.6,31 0.75,31.16 1.35,31.16 R5.1 | 0.6,31 0.6,33.59 | 0.6,33.59 0.6,41.22 | 0.6,41.22 0.6,42.59 0.6,44.87 | C1.1 1.2,41.81 0.6,41.22 | JTAG.2 4.74,50.49 4.43,50.8 2,50.8 1.45,50.25 R1.2 0.6,49.39 0.6,44.87 | U2.17 11.81,34.27 11.12,34.81 6.34,34.81 5.73,35.29 4.44,35.58 2.43,35.58 1.82,34.97 1.82,34.6 R4.2 | R4.2 1.23,34.22 0.6,33.59 | v6.2,26.2 U3.F2 U3.G3 | U3.G6 v9.4,25.4 | U3.G11 v13.4,25.4 | U3.G3 v7.8,25.4 | U3.G3 v7,24.6 | R2.2 1.32,45.59 0.6,44.87 | R4.2 1.5,34.22 | 0.6,22.32 2.07,22.32 2.79,23.03 v3.75,23.64 | C5.1 0.69,27.59 0.6,27.5 | U3.G11 | 0.6,22.32 0.6,17.75 | 0.6,17.75 0.53,17.29 | 0.53,17.29 0.53,11.52 v1.06,10.91 1.11,10.81 R6.2 | FB1.1 1.27,18.42 0.6,17.75 | U4.17 9.96,15.37 9.75,15.15 9.75,15 9.44,14.75 8.22,14.75 7.92,15.15 5.78,15.15 v5.63,15 | v1.24,16.98 0.91,16.98 0.53,17.29
  Top 0.356: REG1.6 9.29,2.27 L1.2 | 7.5,0.99 8.76,0.99 | 8.76,0.99 L1.2 | 8.76,0.99 9.76,0.99 v9.9,0.85 | L1.2 11.49,1.9 REG2.3 REG2.4 | X1.4 X1.1 16.76,1.21 | C10.1 14.02,1.15 X1.4 | X1.4 15.43,1.05 v16.4,2.02
  Bottom 0.254: v7,24.6 v7,23.8 4.38,23.8 v3.75,23.64 | v13.4,25.4 v11.8,25.4 | v7.8,25.4 v9.4,25.4 | v1.24,16.98 2.43,15.76 4.56,15.76 5.22,15.1 5.53,15.1 v5.63,15 | 0.75,10.28 0.75,10.6 v1.06,10.91
  Bottom 0.356: 0.75,10.28 0.75,1.13 1.31,0.57 9.62,0.57 v9.9,0.85 10.03,0.85 10.36,0.57 14.95,0.57 v16.4,2.02
3V3A  (via drill 0.2, 0.5)
  Top 0.254: v7.8,22.2 U3.K4 | v12.6,23 U3.K9 | v8.6,27.8 U3.D4 | U3.D10 v13.4,27.8 | C6.1 1.41,21.66 v2.33,20.89 1.31,19.93 FB1.2
  Bottom 0.254: v8.6,27.8 9,28.2 9.4,28.2 9.8,27.8 9.8,27.6 10.8,26.6 12.8,26.6 13,26.4 13.6,26.4 14.2,27 14.8,27 | v13.4,27.8 14,27.8 14.8,27 | 7.4,22.6 7.07,22.93 2.58,22.93 2.1,22.47 2.1,20.95 v2.33,20.89 | 7.4,22.6 v7.8,22.2 | 14.8,27 14.93,26.87 14.93,26.13 14.47,25.67 14.47,25.21 15,24.68 15,24.6 14.2,23.8 13.4,23.8 v12.6,23 11.8,23.8 8.6,23.8 7.4,22.6
5V0  (via drill 0.2, 0.4, 0.5)
  Top 0.254: REG1.5 7,1.46 v7,1.56 | U1.2 9.34,42.89 8.68,42.89 | 8.68,42.89 8.07,43.5 8.07,43.84 7.61,44.29 4.71,44.29 4.4,44.6 4.4,45.2 3.81,45.79 2.43,45.79 2.1,45.46 2.1,44.71 v1.19,43.8 | C8.1 5.09,3.44 v5.68,4.03 | 8.07,41.87 C2.1 8.02,42.23 8.68,42.89 | POKEYMAX1.17 3.01,10.49 2.05,11.5 1.97,12.56 1.49,13.02 1.49,14.85 1.26,15.1 v1.26,15.76
  Top 0.34: 6.4,3.44 REG1.3
  Top 0.356: 6.4,3.44 C8.1 4.49,3.27 2.58,3.27 1.97,3.88 1.97,7.69 2.98,8.69 POKEYMAX1.17
  Bottom 0.254: v5.68,4.03 8.37,4.03 8.8,3.6 8.8,2.8 7.6,1.6 7.04,1.6 v7,1.56 | v1.19,43.8 0.6,43.4 0.6,16.42 v1.26,15.76
ADC_RX  (via drill 0.2)
  Top 0.152: U3.M13 v15.8,20.6 | v17.67,12.87 17.21,12.87 17.06,13.02 15.69,13.02 v14.77,13.94 | C7.1 19.5,13.22 | 19.5,13.22 R10.2 | 19.5,13.22 18.69,13.22 v18.58,13.33
  Bottom 0.152: v18.58,13.33 18.13,13.33 v17.67,12.87 | v15.8,20.6 15.38,20.18 15.38,19.42 15.08,18.96 14.77,18.66 v14.77,13.94
ADC_TX  (via drill 0.2)
  Top 0.152: U3.L11 v14.2,21.4 | R10.1 19.23,10.73 17.98,10.73 17.06,11.65 17.06,12.26 16.6,12.72 15.08,12.72 14.01,13.78 14.01,14.39 v14.32,14.7
  Bottom 0.152: v14.2,21.4 14.32,21.4 14.77,20.95 14.77,20.34 14.47,20.03 14.47,14.85 v14.32,14.7
AMPIN1M  (via drill 0.2)
  Top 0.203: RN2.1 7.31,42.26 v7.31,42.89 7.31,43.46 RN1.8 | v8.68,44.26 8.68,44.57 9.64,45.48 9.9,45.48 10.2,45.18 10.2,44.72 U1.16
  Bottom 0.203: v7.31,42.89 v8.68,44.26
AMPIN1P  (via drill 0.2)
  Top 0.203: v9.72,44.85 9.29,44.41 9.29,43.45 U1.1 | RN3.1 16.64,44.26 CN1.8 16.74,45.04 16.6,45.18 14.01,45.18 13.71,44.87 12.49,44.87 11.57,45.84 v10.51,45.84
  Bottom 0.203: v9.72,44.85 9.72,45 v10.51,45.84
AMPIN3M  (via drill 0.2)
  Top 0.203: RN1.6 RN2.3 6.09,41.98 6.09,41.52 6.24,41.37 7.31,41.37 7.46,41.22 8.87,41.22 v8.88,41.2 | U1.8 11.56,41.68 v10.96,42.13
  Bottom 0.203: v10.96,42.13 10.61,41.77 9.45,41.77 v8.88,41.2
AMPIN3P  (via drill 0.2)
  Top 0.203: v14.18,43.13 14.23,43.13 | 14.23,43.13 14.47,42.89 15.13,42.89 RN3.4 | 14.23,43.13 13.86,43.5 13.86,43.9 CN1.5
  Top 0.254: U1.9 12.98,41.86 v13.07,41.95
  Bottom 0.254: v13.07,41.95 14.18,43.06 v14.18,43.13
AMPIN4P  (via drill 0.2)
  Top 0.203: RN3.3 15.64,43.4 15.49,43.6 | CN1.6 15.16,43.88 15.49,43.6 | v14.62,43.6 15.49,43.6 | U1.12 12.25,43.62 v12.59,43.96
  Bottom 0.203: v14.62,43.6 14.16,44.01 12.64,44.01 v12.59,43.96
AUD1  (via drill 0.2)
  Top 0.203: U3.C10 v13.4,28.6 | RN3.8 16.64,41.1 v16.6,41.06
  Bottom 0.203: v13.4,28.6 13,28.6 12.8,28.8 12.8,29.63 13.05,29.88 13.05,32.83 12.89,32.98 12.89,35.63 12.18,36.34 12.18,37.71 13.71,39.23 14.77,39.23 v16.6,41.06
AUD3  (via drill 0.2)
  Top 0.203: U3.C9 v11.8,27.8 | RN3.5 15.14,41.12 v15.08,41.06
  Bottom 0.203: v11.8,27.8 11.8,28 12,28.2 12,30.06 12.23,30.29 12.23,32.07 12.03,32.27 12.03,35.27 11.27,36.03 11.27,38.01 13.4,40.15 14.16,40.15 v15.08,41.06
AUD4  (via drill 0.2)
  Top 0.203: U3.D9 v12.6,27.8 | RN3.6 15.64,41.11 v15.69,41.06
  Bottom 0.203: v12.6,27.8 12.6,28 12.4,28.2 12.4,29.85 12.64,30.09 12.64,32.53 12.49,32.68 12.49,35.42 11.73,36.19 11.73,37.86 13.55,39.69 14.32,39.69 14.62,40 14.93,40 15.69,40.76 v15.69,41.06
AUD_IN
  Top 0.152: C12.2 19.46,1.4 18.74,0.68 17.82,0.68 17.36,1.13 17.36,3.42 17.06,3.72 17.06,4.03 15.88,5.21 JP1.9
AUDF1  (via drill 0.2)
  Top 0.203: v10.2,42.28 10.36,42.43 10.36,42.74 10.2,42.89 10.2,43.2 10.56,43.56 U1.15 10.56,45.08 10.96,45.48 11.27,45.48 11.57,45.18 11.57,45.02 12.03,44.57 12.18,44.57 12.34,44.41 12.95,44.41 13.25,44.11 13.25,43.04 13.81,42.48 17.36,42.48 17.44,42.31 POKEYMAX1.37 | RN2.8 7.05,40.25 7.46,39.89 8.88,39.89 v8.88,40
  Bottom 0.203: v8.88,40 8.07,41.22 8.07,42.13 8.22,42.28 v10.2,42.28
AUDF2
  Top 0.203: 10.51,41.12 U1.6
  Top 0.254: 10.51,41.12 10.12,41.12 U1.5
AUDF3
  Top 0.203: C4.2 16.59,47.98 AUD.3
AUDF4
  Top 0.203: C3.2 13.6,48.44 AUD.1
CONF_DONE  (via drill 0.2)
  Top 0.152: U3.C5 v8.6,28.6 | R5.2 1.36,29.94 2.43,31 3.8,31 4.56,30.24 4.56,29.44 v5.4,28.6
  Bottom 0.152: v8.6,28.6 8,28 7.8,28 7.2,28.3 5.7,28.3 v5.4,28.6
FAKE_CLK
  Top 0.152: U3.H8 U3.G9
GND  (via drill 0.2, 0.4, 0.5, 0.6)
  Top 0.152: U4.19 v9.19,15.26 | U4.8 v13.55,15.2 | U4.38 9.16,12.12 v9.11,12.2 | U4.49 13.56,11.81 v13.71,11.95 | U4.55 15.96,11.72 v16.2,11.95 16.36,11.79 U4.56 | C7.2 19.29,15.61 v17.98,15.66 | R8.1 19.5,8.91 v18.43,7.84
  Top 0.203: 9.44,41.79 U1.4 9.38,40.54 v9.62,40.3 9.31,40.6 8.16,40.6 C2.2
  Top 0.254: U2.55 U2.56 5.17,38.37 v4.96,38.32 | 6.5,0.99 C9.2 | 4.79,2.27 C8.2 | v14.2,26.2 U3.E11 v13.4,27 | U3.F3 v7,26.2 | U3.A1 v5.55,30.62 | U3.B8 v11,28.6 | U3.A13 v14.89,31.08 | U3.G7 v11,24.6 | v7.8,23.8 U3.J4 v8.6,23 | U3.M6 v10.2,21.4 | 1.42,40.45 C1.2 | v7.76,45.18 7.22,45.18 RN1.1 RN1.2 RN1.3 RN1.4 5.16,45.01 v5.02,44.87 | U2.49 8.21,37.11 v8.22,37.05 | U2.8 8.21,33.91 8.07,34.05 v8.07,34.2 | U3.L9 v12.6,22.2 | U2.38 12.61,36.67 v12.64,36.64 | REG1.1 7.7,3.2 v8.2,3.2 8.44,3.2 8.68,2.96 REG2.5 11.78,3.21 REG2.2 | U3.D5 v9.4,27 | v14.2,24.6 U3.H12 v15,23.8 | U3.C3 v7,27.8 | U2.19 12.61,31.32 v11.69,30.85 | 1.36,39.16 1.63,39.16 2.4,38.6 v3.6,38.6 | 13.89,41.64 v13.89,41.42 13.91,41.79 12.87,42.86 U1.11 | C11.2 13.61,2.15 | v5.76,18.94 5.76,20.16 U3.N1 | v1.65,2.74 1.11,3.28 R7.1 | v12.77,18.18 13.07,18.18 13.39,18.39 13.55,18.51 13.91,18.86 14.16,18.86 14.77,19.22 15.23,19.22 15.54,19.57 15.54,20.06 U3.N13
  Top 0.356: 6.5,0.99 5.82,0.99 C8.2 4.31,2.14 3.8,2.66 1.73,2.66 v1.65,2.74 | REG1.4 4.79,2.27 | R3.2 1.36,39.16 C1.2 | 1.34,24.32 v1.36,24.3 1.41,24.25 C6.2 | CN1.1 CN1.2 CN1.3 CN1.4 | CN1.4 14.33,45.93 | CN1.4 13.81,45.89 13.4,45.48 12.64,45.48 10.89,47.13 JTAG.5 | 13.75,2.17 C11.2 | REG2.5 12.96,2.96 C11.2 | C11.2 13.72,2.2 v15.23,2.1 15.54,2.2 16.59,3.25 X1.2 | C10.2 13.61,2.04 C11.2 | C5.2 1.58,26.95
  Top 0.457: C5.2 1.34,24.32 | 1.58,26.95 1.97,27.35 1.97,27.5 2.73,28.26 v3.95,28.26
  Bottom 0.152: v9.11,12.2 8.8,11.8 | v13.71,11.95 13.2,11.6 | v17.98,15.66 18.13,15.61 | v18.43,7.84 18.58,7.84
  Bottom 0.254: v1.36,24.3 1.36,23.99 | U3.F3 v7,26.2 7,25.4 7.8,24.6 v7.8,23.8 | v5.55,30.62 U3.A1 | v11,28.6 U3.B8 | v11,24.6 U3.G7 | v10.2,21.4 U3.M6 | v7.76,45.18 7.46,45.02 | v8.22,37.05 8.22,37.25 | v4.96,38.32 4.56,38.17 | v8.07,34.2 8.07,34.81 | 7.27,2.48 v8.2,3.2 | v9.4,27 U3.D5 | v3.6,38.6 3.2,38.4
  pour Bottom (isolate 0.178): 0.4,14 0.14,14 0.14,0.07 3.8,0.2 3.6,4.2 14.35,4.4 14.35,0.2 20.2,0 20.2,53 0,53
LIN0  (via drill 0.2)
  Top 0.152: U3.B1 v6.2,29.4 | U2.2 5.8,32.64 5.8,34.05 v5.95,34.05
  Bottom 0.152: v5.95,34.05 6.2,33.8 v6.2,29.4
LIN1
  Top 0.152: U3.A2 6.6,30.03 6.24,30.39 6.24,32.6 U2.3
LIN2  (via drill 0.2)
  Top 0.152: U3.B2 v7,29.4 | v6.6,34.2 6.6,32.64 U2.4
  Bottom 0.152: v7,29.4 7,33.8 v6.6,34.2
LIN3
  Top 0.152: U3.A3 7.4,30 7,30.39 U2.5
LIN4  (via drill 0.2)
  Top 0.152: U3.B3 v7.8,29.4 | v7.4,34.2 7.4,32.64 U2.6
  Bottom 0.152: v7.8,29.4 7.8,33.8 v7.4,34.2
LIN5
  Top 0.152: U2.7 7.8,32.62 7.8,30.2 U3.A4
LIN6  (via drill 0.2)
  Top 0.152: U3.B4 v8.6,29.4 | U2.9 8.6,32.64 8.6,34.05 v8.75,34.2
  Bottom 0.152: v8.6,29.4 8.6,34.05 v8.75,34.2
LIN7
  Top 0.152: U3.A5 9,32.62 U2.10
LIN8  (via drill 0.2)
  Top 0.152: U3.B5 v9.4,29.4 | v9.4,34.2 9.4,32.64 U2.11
  Bottom 0.152: v9.4,29.4 v9.4,34.2
LIN9
  Top 0.152: U3.A6 9.8,32.62 U2.12
LIN10  (via drill 0.2)
  Top 0.152: U3.B6 v10.2,29.4 | U2.13 10.2,32.64 10.2,34.05 v10.05,34.2
  Bottom 0.152: v10.2,29.4 v10.05,34.2
LIN11
  Top 0.152: 10.6,32.62 U2.14 10.61,31.72 10.2,31.31 10.2,30.2 U3.A7
LIN12  (via drill 0.2)
  Top 0.152: U3.B7 v11,29.4 | U2.15 11,32.64 11,33.9 v10.7,34.2
  Bottom 0.152: v10.7,34.2 10.7,34.09 10.51,33.9 10.51,29.89 v11,29.4
LIN13
  Top 0.152: U2.16 11.41,31.76 10.66,31 10.66,30.55 U3.A8
LIN14
  Top 0.152: 12.2,32.62 U2.18 12.21,31.64 12.03,31.46 11.57,31.46 11.12,31 11.12,30.7 11.57,30.24 11.73,30.24 12.17,29.8 U3.A9
LIN15
  Top 0.152: U2.20 13,32.62 13,31.4 13.1,31.3 13.1,30.55 13,30.45 U3.A10
LIN16  (via drill 0.2)
  Top 0.152: U3.B10 v13.4,29.4 | v13.4,33.85 13.4,32.64 U2.21
  Bottom 0.152: v13.4,29.4 v13.4,33.85
LIN17
  Top 0.152: 13.8,32.62 U2.22 13.81,31.72 13.4,31.31 13.4,30.24 13.8,29.84 U3.A11
LIN18  (via drill 0.2)
  Top 0.152: U3.B11 v14.2,29.4 | U2.23 14.2,32.64 14.2,33.7 v14.05,33.85
  Bottom 0.152: v14.2,29.4 14.2,30.21 13.71,30.7 13.71,31.31 14.16,31.77 14.16,33.73 v14.05,33.85
LIN19
  Top 0.152: 14.6,32.62 U2.24 14.62,32.62 14.62,31.61 14.47,31.46 14.01,31.46 13.71,31.16 13.71,30.7 U3.A12
LIN20  (via drill 0.2)
  Top 0.152: U3.B12 v15,29.4 | U2.25 15,32.64 15,33.44 v14.7,33.85
  Bottom 0.152: v15,29.4 15,30.17 14.77,30.39 14.47,30.39 14.09,30.77 14.09,31.23 14.47,31.61 14.47,33.37 v14.7,33.85
LIN21
  Top 0.152: 15.38,32.6 U2.26 15.41,30.67 15.84,30.24 15.84,29.44 U3.B13
LIN22  (via drill 0.2)
  Top 0.152: U2.27 15.81,33.62 15.93,33.75 v16.25,33.85 | U3.C12 v15,28.6
  Bottom 0.152: v16.25,33.85 15.93,33.75 15.81,33.62 15.81,30.61 15.8,30.6 15.8,29.4 v15,28.6
LIN23
  Top 0.152: U3.D13 15.44,27.4 16.45,28.41 16.45,31.31 16.21,31.55 U2.28
LINB0  (via drill 0.2)
  Top 0.152: U3.G12 v15,25.4 | U4.2 15.96,15.46 16.17,15.26 16.55,15.26 16.76,15.46 16.76,15.76 17.21,16.22 17.21,16.98 17.36,17.14 17.36,17.29 17.82,17.75 18.43,17.75 18.74,18.05 v18.74,18.56
  Bottom 0.152: v15,25.4 15.81,25.4 16.45,24.76 16.45,24.45 16.6,24.3 16.6,23.54 17.36,22.77 17.36,18.96 17.67,18.61 18.69,18.61 v18.74,18.56
LINB1  (via drill 0.2)
  Top 0.152: U3.G13 15.44,25 v15.84,24.6 | U4.3 15.56,17.56 15.6,17.6 17.07,17.6 17.52,18.05 17.87,18.05 v18,18.18
  Bottom 0.152: v15.84,24.6 16.3,24.15 16.3,23.38 17.06,22.62 17.06,18.81 17.67,18.2 v18,18.18
LINB2  (via drill 0.2)
  Top 0.152: U3.H13 15.48,24.2 v15.84,23.84 | v15.99,14.54 15.99,14.85 15.54,15.31 15.38,15.31 15.16,15.53 U4.4
  Bottom 0.152: v15.99,14.54 15.99,14.85 15.54,15.31 15.54,17.59 15.69,17.75 16.45,17.75 16.76,18.05 16.76,22.47 15.99,23.23 15.99,23.69 v15.84,23.84 15.84,23.69
LINB3  (via drill 0.2)
  Top 0.152: v15,23 U3.J12 | U4.5 14.77,16.46 14.77,15.46 15.23,15 v15.23,14.7
  Bottom 0.152: 15.23,22.93 v15,23 15.07,22.93 15.84,22.93 16.45,22.32 16.45,18.2 16.3,18.05 15.38,18.05 15.23,17.9 v15.23,14.7
LINB4
  Top 0.152: U3.J13 15.72,23.08 16.15,23.08 17.21,22.01 17.21,18.2 16.91,17.9 15.38,17.9 15.08,17.59 14.47,17.59 14.36,17.49 U4.6
LINB5
  Top 0.152: U3.K13 15.4,22.64 15.42,22.62 16.15,22.62 16.45,22.32 16.45,22.01 16.91,21.55 16.91,18.36 16.76,18.2 15.23,18.2 14.93,17.9 14.32,17.9 13.96,17.55 U4.7
LINB6  (via drill 0.2)
  Top 0.152: U3.L12 v15,22.2 | v15.84,22.19 16.6,21.45 16.6,18.66 16.45,18.51 15.08,18.51 14.77,18.2 14.16,18.2 13.55,17.59 13.4,17.59 13.16,17.35 U4.9
  Bottom 0.152: v15,22.2 15.8,22.2 v15.84,22.19
LINB7
  Top 0.152: U3.L13 15.6,21.8 16.3,21.1 16.3,18.96 16.15,18.81 14.93,18.81 14.62,18.51 14.04,18.51 13.43,17.9 13.25,17.9 13.1,17.75 12.95,17.75 12.76,17.56 U4.10
LINB8  (via drill 0.2)
  Top 0.152: U3.K12 v14.2,22.2 | v14.93,19.7 14.42,19.68 14.01,19.24 13.68,19.17 13.17,18.66 12.49,18.66 12.34,18.51 12.34,17.59 12.36,17.56 U4.11
  Bottom 0.152: v14.2,22.2 14.28,22.2 14.28,22.05 15.08,21.25 15.08,19.83 v14.93,19.7
LINB9  (via drill 0.2)
  Top 0.152: U3.M12 v14.2,20.6 | U4.12 11.96,18.59 12.34,18.96 13.05,18.96 v13.73,19.64
  Bottom 0.152: 13.96,20.36 v14.2,20.6 13.81,20.21 v13.73,19.64
LINB10  (via drill 0.2)
  Top 0.152: 11.57,16.48 U4.13 11.56,18.65 12.18,19.27 12.82,19.27 v13.1,19.62 | U3.L10 v13.4,21.4
  Bottom 0.152: v13.4,21.4 13.4,20.34 13.1,20.03 v13.1,19.62
LINB11  (via drill 0.2)
  Top 0.152: U3.N9 v12.49,19.7 | U4.14 11.16,18.15 v11.12,18.4
  Bottom 0.152: v11.12,18.4 11.4,18.4 12.49,19.49 v12.49,19.7
LINB12  (via drill 0.2)
  Top 0.152: U3.M9 v11.8,20.6 | v11.8,19.8 11.4,19.7 11.26,19.58 10.66,18.98 10.66,18.2 10.76,18.1 U4.15
  Bottom 0.152: v11.8,20.6 v11.8,19.8
LINB13
  Top 0.152: U3.N8 10.6,19.4 10.51,19.4 10.36,19.25 10.36,18.05 10.36,18.04 U4.16
LINB14  (via drill 0.2)
  Top 0.152: U3.M7 v10.2,20.6 | 9.3,19.7 v9.4,19.8 9.29,19.69 9.29,17.9 9.56,17.62 U4.18
  Bottom 0.152: v10.2,20.6 v9.4,19.8
LINB15
  Top 0.152: U4.20 8.76,19.96 U3.N5
LINB16  (via drill 0.2)
  Top 0.152: U3.M5 v8.6,20.6 | U4.21 8.37,16.46 8.37,15.46 v8.58,15.26
  Bottom 0.152: v8.6,20.6 8.6,20.5 8.5,20.5 8.6,20.4 8.6,15.28 v8.58,15.26
LINB17  (via drill 0.2)
  Top 0.152: U3.L4 v7.8,21.4 | U4.22 7.96,17.49 8.22,17.75 8.22,19.17 v8.07,19.32
  Bottom 0.152: v7.8,21.4 8.1,21 8.1,20.2 v8.07,19.32
LINB18  (via drill 0.2)
  Top 0.152: U3.L3 v7,21.4 | v7.76,18.51 7.76,17.75 7.56,17.55 U4.23
  Bottom 0.152: v7,21.4 7.6,20.8 7.6,18.67 v7.76,18.51
LINB19  (via drill 0.2)
  Top 0.152: U3.M3 v7,20.6 | U4.24 7.16,17.75 7.31,17.9 7.31,19.42 v7,19.72
  Bottom 0.152: v7,20.6 v7,19.73 v7,19.72
LINB20  (via drill 0.2)
  Top 0.152: U3.M2 v6.2,20.6 | U4.25 6.76,18.89 v6.66,19
  Bottom 0.152: v6.66,19 6.66,19.31 6.54,19.42 6.54,20.25 v6.2,20.6
LINB21  (via drill 0.2)
  Top 0.152: U4.26 6.36,18.24 v6.2,18.4 | U3.M1 v6.2,21.4
  Bottom 0.152: v6.2,21.4 5.6,20.8 5.6,20.2 6,19.8 6,19.4 6.2,19.2 v6.2,18.4
LINB22
  Top 0.152: U3.L1 5.57,21.8 5.33,21.55 5.33,18.4 5.96,17.76 U4.27
LINB23
  Top 0.152: U3.K1 5.46,22.6 5.02,22.16 5.02,18.18 5.56,17.64 U4.28
LVLA0  (via drill 0.2)
  Top 0.152: U2.54 6.21,39.26 5.94,39.54 5.2,39.54 4,40.74 4,42.84 v3.34,43.5
  Bottom 0.152: POKEYMAX1.2 3.42,47.39 3.95,46.85 3.95,45.63 4.11,45.48 4.11,44.26 v3.34,43.5
LVLA1
  Top 0.152: U2.53 6.61,39.32 6.09,39.84 5.4,39.84 4.4,40.84 4.4,43.8 3.35,44.85 POKEYMAX1.3
LVLA2
  Top 0.152: U2.52 7.01,37.41 6.8,37.2 5.2,37.2 4.5,38 4.5,39.8 3.25,41.05 3.08,41.22 2.98,41.32 POKEYMAX1.4
LVLA3
  Top 0.152: U2.51 7.46,38.32 7.46,36.95 7.31,36.8 5.21,36.8 4.2,37.8 4.2,38.8 3.23,39.77 POKEYMAX1.5
LVLA4
  Top 0.152: U2.50 7.81,37.3 7.76,37.25 7.76,36.8 7.46,36.49 5.11,36.49 4.37,37.23 POKEYMAX1.6
LVLA5  (via drill 0.2)
  Top 0.152: U2.48 8.61,37.32 8.68,37.25 8.68,36.34 7.76,35.42 v6.39,35.42 | POKEYMAX1.7 v5.66,34.69
  Bottom 0.152: v5.66,34.69 v6.39,35.42
LVLA6
  Top 0.152: U2.47 9.01,36.46 10.2,35.27 11.42,35.27 12.39,34.31 16.45,34.31 16.76,34 16.76,28.87 17.36,28.26 17.36,23.99 18.28,23.08 18.28,22.05 POKEYMAX1.29
LVLA7
  Top 0.152: U2.46 9.41,36.52 10.36,35.58 11.57,35.58 12.54,34.61 16.6,34.61 17.06,34.2 17.06,29.02 17.67,28.41 18.43,28.41 19.04,27.8 19.04,20.27 POKEYMAX1.28
LVLA8
  Top 0.152: 17.36,29.19 17.36,34.36 16.76,34.97 12.64,34.97 11.73,35.88 10.51,35.88 9.81,36.58 U2.45 | 17.36,29.19 17.41,29.19 | 17.36,29.19 17.36,29.18 17.82,28.72 18.58,28.72 19.35,27.96 19.35,18.04 POKEYMAX1.27
LVLA9
  Top 0.152: POKEYMAX1.38 18.22,43.71 19.19,42.74 19.19,41.79 18.8,41.4 18.16,41.4 17.36,40.6 12.18,40.6 11.12,39.54 10.36,39.54 10.21,39.4 U2.44
LVLA10  (via drill 0.2)
  Top 0.152: U2.43 10.61,36.69 11.12,36.19 11.88,36.19 12.79,35.27 v17.21,35.27
  Bottom 0.152: v17.21,35.27 17.52,35.58 18.74,35.58 19.19,35.12 19.19,28.65 18.22,27.68 POKEYMAX1.31
LVLA11  (via drill 0.2)
  Top 0.152: U2.42 11.01,36.75 11.27,36.49 12.03,36.49 12.95,35.58 16.45,35.58 v16.6,35.73
  Bottom 0.152: v16.6,35.73 17.21,35.73 17.36,35.88 18.89,35.88 19.5,35.27 19.5,27.04 18.28,25.82 18.28,24.59 POKEYMAX1.30
LVLA12  (via drill 0.2)
  Top 0.152: U2.41 11.41,39.38 12.34,40.3 17.52,40.3 17.82,40.6 18.13,40.6 v18.43,40.91
  Bottom 0.152: v18.43,40.91 18.58,40.91 19.04,41.37 19.04,46.57 POKEYMAX1.39
LVLA13
  Top 0.152: 18.15,39.84 POKEYMAX1.36 17.99,40 12.49,40 11.81,39.32 U2.40
LVLA14
  Top 0.152: U2.39 12.21,39.26 12.64,39.69 17.06,39.69 17.82,38.93 18.58,38.93 19.04,39.39 19.04,40.76 19.5,41.22 19.5,47.92 18.22,49.2 POKEYMAX1.40
LVLA15
  Top 0.152: POKEYMAX1.34 18.22,35.03 17.06,36.19 16.3,36.19 15.99,35.88 13.25,35.88 13.1,36.03 13.1,36.8 13.01,36.88 U2.37
LVLA16
  Top 0.152: U2.36 13.41,36.33 13.55,36.19 15.84,36.19 16.15,36.49 17.21,36.49 17.67,36.03 18.28,36.03 19.04,35.27 19.04,32.97 POKEYMAX1.33
LVLA17
  Top 0.152: POKEYMAX1.32 18.89,30.28 18.89,31.46 19.35,31.92 19.35,35.73 18.74,36.34 17.82,36.34 17.36,36.8 15.99,36.8 15.69,36.49 13.86,36.49 13.71,36.64 13.71,37.41 13.81,37.51 U2.35
LVLA18  (via drill 0.2)
  Top 0.152: U2.34 14.21,37.2 v14.14,37.15
  Bottom 0.152: POKEYMAX1.35 17.94,36.95 17.82,36.95 17.21,36.34 14.77,36.34 14.16,36.95 v14.14,37.15
LVLA19  (via drill 0.2)
  Top 0.152: U2.33 14.61,37.31 v14.72,37.1
  Bottom 0.152: v14.72,37.1 14.77,36.95 15.08,36.64 16.76,36.64 17.36,37.25 17.36,37.56 17.98,38.17 18.63,38.17 19.04,37.76 19.04,36.34 19.8,35.58 19.8,26.89 19.19,26.28 19.19,23.08 19.5,22.77 19.5,15.65 POKEYMAX1.26
LVLA20  (via drill 0.2)
  Top 0.152: U2.32 15.01,37.62 15.08,37.56 15.08,37.46 v15.31,37.08 | v19.5,36.49 19.65,36.34 19.65,17.59 19.04,16.98 19.04,16.37 18.74,16.09 17.67,16.09 17.36,15.76 17.36,13.94 18.22,13.08 POKEYMAX1.25
  Bottom 0.152: v15.31,37.08 16.65,37.15 16.65,37.3 17.82,38.47 18.74,38.47 19.35,37.86 19.35,36.9 v19.5,36.49
LVLA21
  Top 0.152: 15.41,37.53 U2.31 15.41,39.26 15.54,39.41 16.88,39.41 17.67,38.62 18.74,38.62 19.35,39.23 19.35,40.6 19.8,41.06 19.8,48.99 19.19,49.6 19.19,50.36 18.43,51.12 15.99,51.12 AUD.4
LVLA22
  Top 0.152: U2.30 15.81,37.59 16.09,37.25 17.06,37.25 17.82,38.06 19.3,38.06 19.96,37.41 19.96,16.68 20.2,16.37 20.2,10.52 20.11,10.43 18.74,10.43 18.22,9.91 POKEYMAX1.24
LVLA23  (via drill 0.2)
  Top 0.152: U2.29 16.86,38.37 16.91,38.34 19.52,38.34 v19.8,38.62
  Bottom 0.152: v19.8,38.62 20.11,38.32 20.11,26.74 19.5,26.13 19.5,23.23 19.8,22.93 19.8,15.15 19.35,14.7 19.35,10.43 19.5,10.28 19.5,9.73 19.04,9.27 19.04,8.91 18.58,8.45 17.98,8.45 17.67,8.14 17.67,7.53 18.22,6.98 POKEYMAX1.23
LVLB0
  Top 0.152: U4.54 15.56,9.79 15.84,9.52 16.3,9.52 17.21,8.6 17.21,4.94 17.95,4.21 POKEYMAX1.22
LVLB1
  Top 0.152: U4.53 15.16,9.73 15.69,9.21 16.15,9.21 16.91,8.45 16.91,4.79 17.36,4.33 17.36,3.88 17.98,3.27 17.98,1.92 POKEYMAX1.21
LVLB2
  Top 0.152: U4.52 14.76,8.76 15.23,8.3 15.65,8.3 JP1.10
LVLB3
  Top 0.152: U4.51 14.36,6.55 JP1.7
LVLB4
  Top 0.152: U4.50 13.96,8.69 JP1.8
LVLB5
  Top 0.152: U4.48 13.16,9.58 11.88,8.3 11.88,7.38 11.42,6.92 11.42,6.15 JP1.5
LVLB6
  Top 0.152: U4.47 12.76,9.64 11.88,8.75 11.48,8.75 JP1.6
LVLB7
  Top 0.152: U4.46 12.36,9.7 12.03,9.36 9.75,9.36 9.29,8.91 9.29,7.08 8.68,6.47 8.68,5.95 JP1.3
LVLB8
  Top 0.152: U4.45 11.96,9.75 11.88,9.67 8.83,9.67 8.22,9.06 8.22,8.11 JP1.4
LVLB9  (via drill 0.2)
  Top 0.152: 20.21,4.94 20.21,6.93 R8.2 20.21,8.41 20.21,9.82 20.11,9.97 v19.04,9.97 | 20.21,4.94 20.21,3.46 C12.1 | R9.1 19.69,5.9 20.21,4.94 | U4.44 11.56,11.64 11.73,11.8 12.95,11.8 13.71,12.56 14.47,12.56 14.62,12.41 16.45,12.41 16.76,12.11 16.76,11.34 17.67,10.43 v17.98,10.28
  Bottom 0.152: v19.04,9.97 18.74,10.28 v17.98,10.28
LVLB10  (via drill 0.2)
  Top 0.152: U4.43 11.16,13.28 10.36,14.09 5.63,14.09 5.02,14.7 5.02,15.31 4.72,15.61 4.72,22.32 5.33,22.93 5.33,24.6 4.87,25.06 4.87,28.72 4.26,29.33 4.26,30.09 3.78,30.57 v3.04,30.57
  Bottom 0.152: POKEYMAX1.8 2.98,30.91 3.04,30.85 v3.04,30.57
LVLB11
  Top 0.152: U4.42 10.76,13.07 10.05,13.78 5.48,13.78 4.72,14.54 4.72,15.15 4.41,15.46 4.41,22.47 5.02,23.08 5.02,24.45 4.56,24.91 4.56,28.57 3.58,29.55 3.04,29.55 POKEYMAX1.9
LVLB12
  Top 0.152: POKEYMAX1.10 2.98,25.88 4.72,24.15 4.72,23.23 4.11,22.62 4.11,15.31 4.41,15 4.41,14.39 5.33,13.48 9.75,13.48 9.9,13.33 10.05,13.17 10.36,12.86 U4.41
LVLB13
  Top 0.152: POKEYMAX1.11 3.21,24.3 4.11,24.3 4.41,23.99 4.41,23.38 3.8,22.77 3.8,15.15 4.11,14.85 4.11,14.24 5.17,13.17 9.59,13.17 9.96,12.8 U4.40
LVLB14
  Top 0.152: POKEYMAX1.14 3.04,16.85 3.04,15.46 3.78,14.72 3.8,14.72 3.8,13.94 4.87,12.87 9.29,12.87 9.44,12.72 9.56,12.59 U4.39
LVLB15
  Top 0.152: POKEYMAX1.15 2.98,14.3 4.72,12.56 8.22,12.56 8.53,12.26 8.53,12.11 8.76,11.87 U4.37
LVLB16
  Top 0.152: POKEYMAX1.13 2.98,19.06 2.28,18.36 2.28,17.75 2.12,17.59 2.12,16.53 2.43,16.22 2.43,15.15 2.12,14.85 2.12,13.63 2.73,13.02 3.65,13.02 4.41,12.26 7.92,12.26 8.36,11.81 U4.36
LVLB17
  Top 0.152: POKEYMAX1.12 2.98,20.58 2.73,20.34 2.43,20.18 1.97,19.73 1.97,17.9 1.82,17.75 1.82,16.37 2.12,16.07 2.12,15.31 1.82,15 1.82,13.33 2.43,12.72 3.34,12.72 4.11,11.95 7.61,11.95 7.96,11.6 U4.35
LVLB18
  Top 0.152: U4.34 7.56,9.16 6.85,8.45 6.85,6.66 JP1.1
LVLB19
  Top 0.152: U4.33 7.16,9.22 6.24,8.3 5.95,8.3 JP1.2
LVLB20  (via drill 0.2)
  Top 0.152: U4.32 6.76,9.28 6.54,9.06 5.33,9.06 4.4,8.13 4.4,7.09 v4.56,6.92
  Bottom 0.152: v4.56,6.92 4.41,6.77 4.41,5.86 3.8,5.25 3.8,2.81 2.98,1.99 POKEYMAX1.20
LVLB21
  Top 0.152: POKEYMAX1.19 2.98,5.18 4,6.2 4,8.34 5.02,9.36 6.24,9.36 6.36,9.49 U4.31
LVLB22
  Top 0.152: U4.30 5.96,9.7 5.94,9.67 4.87,9.67 2.98,7.78 POKEYMAX1.18
LVLB23
  Top 0.152: U4.29 4.08,10.73 POKEYMAX1.16
N$5  (via drill 0.2)
  Top 0.203: v11.12,44.97 11.12,44.09 U1.14 | RN2.5 5.55,40.99 v5.17,41.37 | v12.89,46.24 12.95,46.46 C3.1
  Bottom 0.203: v5.17,41.37 6.24,41.37 7.15,42.28 7.61,42.28 8.07,42.74 9.14,42.74 9.29,42.89 10.36,42.89 10.66,42.64 11.27,42.64 11.57,42.89 11.57,43.35 11.42,43.5 11.42,44.67 v11.12,44.97 | 11.12,44.72 v11.12,44.97 | v12.89,46.24 11.68,45.02 11.17,45.02 v11.12,44.97
N$7  (via drill 0.2)
  Top 0.203: U1.7 11.06,40.14 v11.02,40.1 10.46,40.1 9.9,39.54 6.85,39.54 6.05,40.33 RN2.6 | C4.1 14.62,47.01 v14.47,46.85
  Bottom 0.203: v11.02,40.1 11.42,40.5 11.42,41.82 12.03,42.59 12.03,44.72 13.86,46.55 14.16,46.55 v14.47,46.85
N$22  (via drill 0.2)
  Top 0.203: RN2.4 5.55,42.05 | RN1.5 5.53,43.71 | U1.13 11.56,43.64 11.12,43.2 v10.91,43.2
  Top 0.254: 5.55,42.05 5.55,42.86 v5.53,42.89 5.55,42.92 RN1.5
  Bottom 0.203: 6.85,43.5 8.22,44.87 8.98,44.87 9.29,44.57 9.29,43.96 9.9,43.35 10.51,43.35 10.66,43.2 v10.91,43.2
  Bottom 0.254: 6.85,43.5 6.85,43.2 6.54,42.89 v5.53,42.89
N$137
  Top 0.254: L1.1 8.78,3.79 | REG1.2
  Top 0.34: 7,3.75 REG1.2
  Top 0.356: 8.78,3.79 8.37,4.2 7.46,4.2 7,3.75
NSTATUS  (via drill 0.2)
  Top 0.152: U3.C4 v7.8,28.6 | R4.1 2.12,32.08 2.12,31.77 2.58,31.31 4.11,31.31 4.87,30.55 4.87,29.93 v5.4,29.4
  Bottom 0.152: v5.4,29.4 6,28.8 7.4,28.8 7.6,28.6 v7.8,28.6
OSC_CLOCK  (via drill 0.2)
  Top 0.152: U3.E13 U3.F13 16.02,25.8 17.06,24.76 17.06,23.69 v17.67,23.08 | v15.64,3.98 14.98,3.21 X1.3
  Bottom 0.152: v17.67,23.08 18.58,23.08 19.19,22.47 19.19,15.92 18.51,15.23 17.75,15.23 17.36,14.85 17.36,13.48 17.21,13.33 17.21,5.4 16.3,4.49 16.15,4.49 v15.64,3.98
PTHRES  (via drill 0.2)
  Top 0.152: v9.4,20.6 U3.N6 10.2,19.8 | v9.4,21.4 U3.L5 U3.M4 7.8,20.6 U3.N4 | 10.2,19.8 U3.N7 U3.M8 v11.8,21.4 | v12.6,21.4 U3.M10 U3.N10 | 10.2,19.8 10.2,19.72 9.9,19.42 v9.9,18.2 | R6.1 1.37,8 1.97,8.6 1.97,11.04 1.52,11.5 1.52,12.41 1.01,12.92 v1.01,14.54 | v10.81,15.15 10.51,15.15 9.75,14.39 6.39,14.39 v6.24,14.54
  Top 0.254: R7.2 R6.1
  Bottom 0.152: v9.4,20.6 v9.4,21.4 | v11.8,21.4 v12.6,21.4 | v10.81,15.15 10.81,16.37 9.9,17.29 v9.9,18.2 | v1.01,14.54 1.77,15.31 4.41,15.31 5.33,14.39 6.09,14.39 v6.24,14.54
TCK  (via drill 0.2)
  Top 0.152: U3.G2 v6.2,25.4 | R3.1 1.36,35.5 v1.44,35.42
  Bottom 0.152: v6.2,25.4 4.07,25.4 3.65,25.82 2.02,25.82 1.26,26.58 1.26,35.27 v1.44,35.42 1.41,35.45 1.41,42.84 2.02,43.4 2.02,44.21 1.4,44.84 1.4,47.6 1.6,47.8 1.6,50.4 2.2,51 7,51 8.27,49.73 JTAG.4
TDI  (via drill 0.2)
  Top 0.152: JTAG.3 6.85,48.38 6.83,48.4 4.6,48.4 4.05,48.95 v2.2,48.95 R1.1 | v8.6,26.2 U3.F5
  Bottom 0.152: v8.6,26.2 7.9,26.2 6.9,26.8 5.97,26.8 5.6,26.43 5.6,26.2 5.2,25.8 4.4,25.8 4.07,26.13 2.33,26.13 1.57,26.89 1.57,34.87 1.97,35.27 1.97,35.73 1.82,35.88 1.82,42.79 2.33,43.25 2.33,44.31 1.8,44.89 1.8,47.4 2,47.6 2,48 2.4,48.4 2.4,48.75 v2.2,48.95
TDO  (via drill 0.2)
  Top 0.152: U3.F6 v9.4,26.2 | JTAG.6 9.44,48.3 9.2,48.06 9.2,46.15 9.03,45.98 8.68,45.63 7.15,45.63 7,45.79 4.72,45.79 4.26,46.24 2.97,46.24 v2.95,46.27
  Bottom 0.152: v9.4,26.2 8.6,26.8 7.9,26.8 7.1,27.2 5.8,27.2 5.2,26.6 5.2,26.4 5,26.2 4.4,26.2 4,26.6 3.95,27.4 3.39,27.96 2.02,27.96 1.87,28.11 1.87,34.71 2.28,35.14 2.28,35.88 2.12,36.03 2.12,42.64 2.68,43.19 2.68,43.75 2.89,43.96 3.34,43.96 3.8,44.41 3.8,45.38 v2.95,46.27
TMS  (via drill 0.2)
  Top 0.152: 1.47,46.89 R2.1 1.36,47.46 1.82,47.92 | U3.G1 v6.2,24.6 | JTAG.1 4.95,47.92 4.48,47.92 4,48.4 2.3,48.4 1.82,47.92 | v1.1,47.92 1.82,47.92
  Bottom 0.152: v1.1,47.92 1,47.82 1,44.8 1.03,44.8 1.72,44.06 1.72,43.55 0.96,42.84 0.96,26.28 1.72,25.52 3.5,25.52 3.95,25.06 5.02,25.06 5.48,24.6 v6.2,24.6